# Altium project PCB_STM32F4.PrjPcb
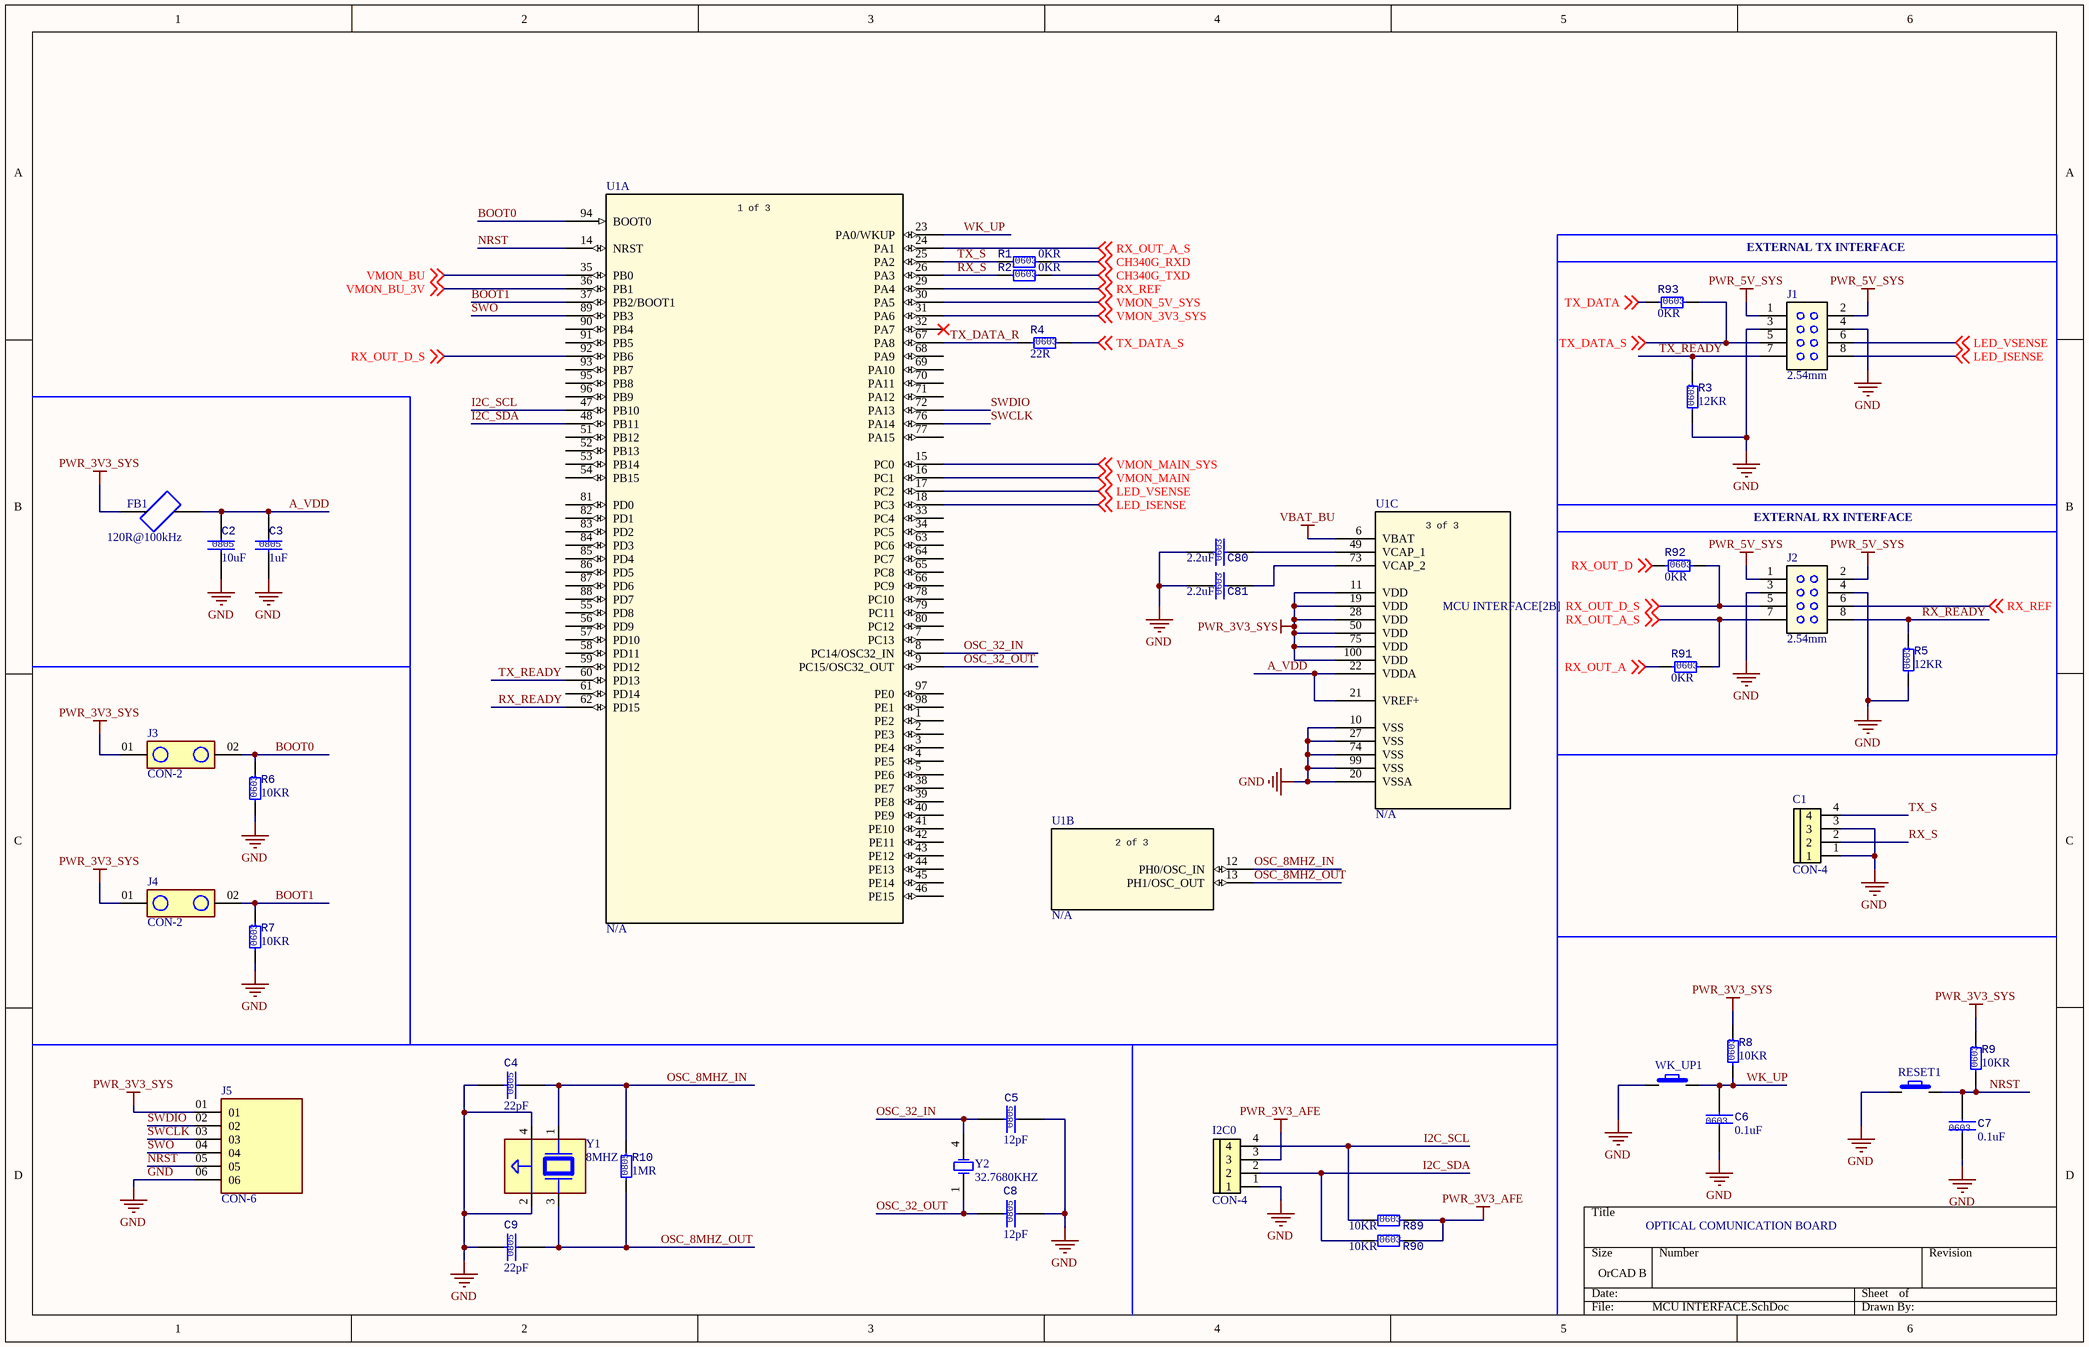
[diagram p0: MCU INTERFACE.SchDoc]
7 sheets, 233 parts. Net scope: global (net labels, ports and power ports of the same name join across sheets).
Board file: PCB1.PcbDoc
Sheets:
  MCU INTERFACE.SchDoc
  PW SUPPLY.SchDoc
  UART TO USB LOG.SchDoc
  Transmitter_MD.SchDoc
  Receiver_VLC.SchDoc
  VOLTAGE_MONITOR.SchDoc
  PWR_AFE.SchDoc

## Sheet MCU INTERFACE.SchDoc
size OrCAD B; SheetNumber: 1; SheetTotal: 7

### Parts
C1  value CON-4  [CON-4]  (hidden comment: CONNECTOR_4)
C2  Size: 0805  [CAPCER 0603 SMD]  (hidden comment: 10uF)
C3  Size: 0805  [CAPCER 0805 SMD]  (hidden comment: 1uF)
C4  value 22pF  Size: 0805  [CAPCER 0805 SMD]  (hidden comment: 22uF)
C5  Size: 0805  [CAPCER 0805 SMD]  (hidden comment: 12pF)
C6  Size: 0603  [CAPCER 0805 SMD]  (hidden comment: 0.1uF)
C7  Size: 0603  [CAPCER 0805 SMD]  (hidden comment: 0.1uF)
C8  Size: 0805  [CAPCER 0805 SMD]  (hidden comment: 12pF)
C9  value 22pF  Size: 0805  [CAPCER 0805 SMD]  (hidden comment: 22uF)
C80  Size: 0603  [CAPCER 0603 SMD]  (hidden comment: 2.2uF)
C81  Size: 0603  [CAPCER 0603 SMD]  (hidden comment: 2.2uF)
FB1  120R@100kHz  [FB 0805]
I2C0  value CON-4  [CON-4]  (hidden comment: CONNECTOR_4)
J1  value 2.54mm  [HD_2X4_2P54_M_V]  (hidden comment: HD_2X4_M_V)
J2  value 2.54mm  [HD_2X4_2P54_M_V]  (hidden comment: HD_2X4_M_V)
J3  value CON-2  [CON-2]  (hidden comment: CONNECTOR_2)
J4  value CON-2  [CON-2]  (hidden comment: CONNECTOR_2)
J5  value CON-6  [CON-6]  (hidden comment: CONNECTOR_6)
R1  value 0KR  Size: 0603  [RESC 0603(1608) SMD]  (hidden comment: 0R)
R2  value 0KR  Size: 0603  [RESC 0603(1608) SMD]  (hidden comment: 0R)
R3  Size: 0603  [RESC 0603(1608) SMD]  (hidden comment: 12KR)
R4  Size: 0603  [RESC 0603(1608) SMD]  (hidden comment: 22R)
R5  Size: 0603  [RESC 0603(1608) SMD]  (hidden comment: 12KR)
R6  Size: 0603  [RESC 0603(1608) SMD]  (hidden comment: 10KR)
R7  Size: 0603  [RESC 0603(1608) SMD]  (hidden comment: 10KR)
R8  Size: 0603  [RESC 0603(1608) SMD]  (hidden comment: 10KR)
R9  Size: 0603  [RESC 0603(1608) SMD]  (hidden comment: 10KR)
R10  value 1MR  Size: 0805  [CAPCER 0805 SMD]  (hidden comment: Điện Trở 1 MOhm 0805 1%)
R89  Size: 0603  [RESC 0603(1608) SMD]  (hidden comment: 10KR)
R90  Size: 0603  [RESC 0603(1608) SMD]  (hidden comment: 10KR)
R91  value 0KR  Size: 0603  [RESC 0603(1608) SMD]  (hidden comment: 0R)
R92  value 0KR  Size: 0603  [RESC 0603(1608) SMD]  (hidden comment: 0R)
R93  value 0KR  Size: 0603  [RESC 0603(1608) SMD]  (hidden comment: 0R)
RESET1  BUTTON  [BUTTON_SMD]  (value not drawn)
U1  STM32F407VET6  [100LQFP]  (value not drawn)  (parts A,B,C of 3)
WK_UP1  BUTTON  [BUTTON_SMD]  (value not drawn)
Y1  value 8MHZ  [XTAL_5032]  (hidden comment: XTAL_8Mhz)
Y2  value 32.7680KHZ  [4-SOJ]  (hidden comment: XTAL_32.786K)

### Nets
GND: C1.1 C1.3 C2.2 C3.2 C4.1 C5.2 C6.1 C7.1 C8.2 C9.1 C80.1 C81.1 I2C0.1 J1.3 J1.4 J2.3 J2.4 J5.06 R3.1 R5.1 R6.1 R7.1 RESET1.1 U1.10(VSS) U1.20(VSSA) U1.27(VSS) U1.74(VSS) U1.99(VSS) WK_UP1.1 Y1.2(GND) Y1.4(GND)
PWR_3V3_AFE: I2C0.3 R89.2 R90.2
PWR_3V3_SYS: FB1.1 J3.01 J4.01 J5.01 R8.2 R9.2 U1.11(VDD) U1.19(VDD) U1.28(VDD) U1.50(VDD) U1.75(VDD) U1.100(VDD)
PWR_5V_SYS: J1.1 J1.2 J2.1 J2.2
VBAT_BU: U1.6(VBAT)
A_VDD: C2.1 C3.1 FB1.2 U1.21(VREF+) U1.22(VDDA)
BOOT0: J3.02 R6.2 U1.94(BOOT0)
BOOT1: J4.02 R7.2 U1.37(PB2/BOOT1)
CH340G_RXD: R1.2 ; off-sheet CH340G_RXD
CH340G_TXD: R2.2 ; off-sheet CH340G_TXD
I2C_SCL: I2C0.4 R89.1 U1.47(PB10)
I2C_SDA: I2C0.2 R90.1 U1.48(PB11)
LED_ISENSE: J1.8 U1.18(PC3) ; off-sheet LED_ISENSE
LED_VSENSE: J1.6 U1.17(PC2) ; off-sheet LED_VSENSE
NRST: C7.2 J5.05 R9.1 RESET1.2 U1.14(NRST)
OSC_8MHZ_IN: C4.2 R10.2 U1.12(PH0/OSC_IN) Y1.1
OSC_8MHZ_OUT: C9.2 R10.1 U1.13(PH1/OSC_OUT) Y1.3
OSC_32_IN: C5.1 U1.8(PC14/OSC32_IN) Y2.4(OSC2)
OSC_32_OUT: C8.1 U1.9(PC15/OSC32_OUT) Y2.1(OSC1)
RX_OUT_A: R91.1 ; off-sheet RX_OUT_A
RX_OUT_A_S: J2.7 R91.2 U1.24(PA1) ; off-sheet RX_OUT_A_S
RX_OUT_D: R92.1 ; off-sheet RX_OUT_D
RX_OUT_D_S: J2.5 R92.2 U1.92(PB6) ; off-sheet RX_OUT_D_S
RX_READY: J2.8 R5.2 U1.62(PD15)
RX_REF: J2.6 U1.29(PA4) ; off-sheet RX_REF
RX_S: C1.2 R2.1 U1.26(PA3)
SWCLK: J5.03 U1.76(PA14)
SWDIO: J5.02 U1.72(PA13)
SWO: J5.04 U1.89(PB3)
TX_DATA: R93.1 ; off-sheet TX_DATA
TX_DATA_R: R4.1 U1.67(PA8)
TX_DATA_S: J1.5 R4.2 R93.2 ; off-sheet TX_DATA_S
TX_READY: J1.7 R3.2 U1.60(PD13)
TX_S: C1.4 R1.1 U1.25(PA2)
VMON_3V3_SYS: U1.31(PA6) ; off-sheet VMON_3V3_SYS
VMON_5V_SYS: U1.30(PA5) ; off-sheet VMON_5V_SYS
VMON_BU: U1.35(PB0) ; off-sheet VMON_BU
VMON_BU_3V: U1.36(PB1) ; off-sheet VMON_BU_3V
VMON_MAIN: U1.16(PC1) ; off-sheet VMON_MAIN
VMON_MAIN_SYS: U1.15(PC0) ; off-sheet VMON_MAIN_SYS
WK_UP: C6.2 R8.1 U1.23(PA0/WKUP) WK_UP1.2
NetC80_2: C80.2 U1.49(VCAP_1)
NetC81_2: C81.2 U1.73(VCAP_2)

Not connected (* = marked no-connect by the designer): U1 1(PE2) 2(PE3) 3(PE4) 4(PE5) 5(PE6) 7(PC13) 32(PA7)* 33(PC4) 34(PC5) 38(PE7) 39(PE8) 40(PE9) 41(PE10) 42(PE11) 43(PE12) 44(PE13) 45(PE14) 46(PE15) 51(PB12) 52(PB13) 53(PB14) 54(PB15) 55(PD8) 56(PD9) 57(PD10) 58(PD11) 59(PD12) 61(PD14) 63(PC6) 64(PC7) 65(PC8) 66(PC9) 68(PA9) 69(PA10) 70(PA11) 71(PA12) 77(PA15) 78(PC10) 79(PC11) 80(PC12) 81(PD0) 82(PD1) 83(PD2) 84(PD3) 85(PD4) 86(PD5) 87(PD6) 88(PD7) 90(PB4) 91(PB5) 93(PB7) 95(PB8) 96(PB9) 97(PE0) 98(PE1)

### Notes on the sheet
- EXTERNAL TX INTERFACE
- EXTERNAL RX INTERFACE
- OPTICAL COMUNICATION BOARD
- (in symbol DB-0071, part A) 1 of 3
- (in symbol DB-0071, part B) 2 of 3
- (in symbol DB-0071, part C) 3 of 3

### Library data of the parts
C1 I2C0 = DB-0049: Hàng Rào Đực Đơn 2.54mm 40 Chân 1 Hàng Cao 11.2mm Xuyên Lỗ; Design Item ID: DB-0049; Type: CONNECTOR; Power Rate: N/A; Tolerance: N/A; Footprint Type: TFT; Size: TFT; Supplier: THEGIOIIC; Supplier Part Number: Hàng Rào Đực Đơn 2.54mm 40 Chân 1 Hàng Cao 11.2mm Xuyên Lỗ; Supplier Link: https://www.thegioiic.com/hang-rao-duc-don-2-54mm-40-chan-1-hang-cao-11-2mm-xuyen-lo
C2 = DB-0018: CAPACITOR SMD 10uF 25V 10% 0805; Design Item ID: DB-0018; Value: 10uF; Type: CAPACITOR; Power Rate: N/A; Tolerance: 10%; Footprint Type: SMD; Supplier: THEGIOIIC; Supplier Part Number: Tụ Gốm 0805 10uF 25V; Supplier Link: https://www.thegioiic.com/tu-gom-0805-10uf-25v
C3 = DB-0063: CAPACITOR SMD 1uF 16V 10% 0805; Value: 1uF; Design Item ID: DB-0063; Type: CAPACITOR; Power Rate: N/A; Tolerance: 10%; Footprint Type: SMD; Supplier: THEGIOIIC; Supplier Part Number: Tụ Gốm 0805 1uF 16V; Supplier Link: https://www.thegioiic.com/tu-gom-0805-1uf-16v
C4 C9 = DB-0047: CAPACITOR SMD 22pF 50V 10% 0805; Design Item ID: DB-0047; Type: CAPACITOR; Power Rate: N/A; Tolerance: 10%; Footprint Type: SMD; Supplier: THEGIOIIC; Supplier Part Number: Tụ Gốm 0805 22pF 50V; Supplier Link: https://www.thegioiic.com/tu-gom-0805-22pf-50v
C5 C8 = DB-0075: CAPACITOR SMD 12pF 50V 10% 0805; Design Item ID: DB-0075; Type: CAPACITOR; Power Rate: N/A; Value: 12pF; Tolerance: 10%; Footprint Type: SMD; Supplier: THEGIOIIC; Supplier Part Number: Tụ Gốm 0805 12pF 50V; Supplier Link: https://www.thegioiic.com/tu-gom-0805-4-7uf-50v
C6 C7 = DB-0017: CAPACITOR SMD 0.1uF 50V 10% 0603; Value: 0.1uF; Design Item ID: DB-0017; Type: CAPACITOR; Power Rate: N/A; Tolerance: 10%; Footprint Type: SMD; Supplier: THEGIOIIC; Supplier Part Number: Tụ Gốm 0603 100nF (0.1uF) 25V; Supplier Link: https://www.thegioiic.com/tu-gom-0603-100nf-0-1uf-25v
C80 C81 = Tụ Gốm 0603 2.2uF 50V: Value: 2.2uF; Design Item ID: DB-0027; Footprint Type: SMD; Supplier: THEGIOIIC; Supplier Link: https://www.thegioiic.com/tu-gom-0603-2-2uf-50v
FB1 = DB-0076: CBW201209U121T Ferrite Beads 2A 120 Ohm 0805; Design Item ID: DB-0076; Value: 120R@100kHz; Type: FERRITE BEADS; Power Rate: N/A; Tolerance: N/A; Footprint Type: SMD; Size: 0805; Supplier: THEGIOIIC; Supplier Part Number: CBW201209U121T Ferrite Beads 2A 120 Ohm 0805; Supplier Link: https://www.thegioiic.com/cbw201209u121t-ferrite-beads-2a-120-ohm-0805
J1 J2 = DB-0006: Design Item ID: DB-0006; Type: HEADER; Footprint Type: THT; Size: HD_2X4_FM_RA; Supplier: THEGIOIIC; Supplier Link: https://www.thegioiic.com/hang-rao-duc-doi-2-54mm-80-chan-2-hang-cao-11-2mm-xuyen-lo-chan-ma-vang
J3 J4 = DB-0085: Hàng Rào Đực Đơn 2.54mm 40 Chân 1 Hàng Cao 11.2mm Xuyên Lỗ; Design Item ID: DB-0085; Type: CONNECTOR; Power Rate: N/A; Tolerance: N/A; Footprint Type: TFT; Size: TFT; Supplier: THEGIOIIC; Supplier Part Number: Hàng Rào Đực Đơn 2.54mm 40 Chân 1 Hàng Cao 11.2mm Xuyên Lỗ; Supplier Link: https://www.thegioiic.com/hang-rao-duc-don-2-54mm-40-chan-1-hang-cao-11-2mm-xuyen-lo
J5 = DB-0084: Hàng Rào Đực Đơn 2.54mm 40 Chân 1 Hàng Cao 11.2mm Xuyên Lỗ; Design Item ID: DB-0084; Type: CONNECTOR; Power Rate: N/A; Tolerance: N/A; Footprint Type: TFT; Size: TFT; Supplier: THEGIOIIC; Supplier Part Number: Hàng Rào Đực Đơn 2.54mm 40 Chân 1 Hàng Cao 11.2mm Xuyên Lỗ; Supplier Link: https://www.thegioiic.com/hang-rao-duc-don-2-54mm-40-chan-1-hang-cao-11-2mm-xuyen-lo
R1 R2 R91-R93 = DB-0040: RESISTOR SMD 0KR OHM 1% 100mW 0603; Power Rate: 100mW; Design Item ID: DB-0040; Type: RESISTOR; Tolerance: 1%; Footprint Type: SMD; Supplier: THEGIOIIC; Supplier Part Number: Điện Trở 0 Ohm 0603 1%; Supplier Link: https://www.thegioiic.com/dien-tro-0-ohm-0603-1-
R3 R5 = DB-0027: RESISTOR SMD 12KR OHM 1% 100mW 0603; Power Rate: 100mW; Design Item ID: DB-0027; Value: 12KR; Type: RESISTOR; Tolerance: 1%; Footprint Type: SMD; Supplier: THEGIOIIC; Supplier Part Number: Điện Trở 12 KOhm 0603 1%; Supplier Link: https://www.thegioiic.com/dien-tro-12-kohm-0603-1-
R4 = DB-0007: Power Rate: *; Design Item ID: DB-0007; Value: 22R; Type: RESISTOR; Footprint Type: SMD; Supplier: THEGIOIIC; Supplier Link: https://www.thegioiic.com/dien-tro-22-ohm-0603-1-
R6-R9 R89 R90 = DB-0003: RESISTOR SMD 10KR OHM 1% 100mW 0603; Power Rate: 100mW; Design Item ID: DB-0003; Value: 10KR; Type: RESISTOR; Tolerance: 1%; Footprint Type: SMD; Supplier: THEGIOIIC; Supplier Part Number: Điện Trở 10 KOhm 0603 1%; Supplier Link: https://www.thegioiic.com/dien-tro-10-kohm-0603-1-
R10 = DB-0074: RESISTOR SMD 1 MOHM 1% 100mW 0805; Power Rate: 100mW; Design Item ID: DB-0074; Type: RESISTOR; Tolerance: 1%; Footprint Type: SMD; Supplier: THEGIOIIC; Supplier Part Number: Điện Trở 1 MOhm 0805 1%; Supplier Link: https://www.thegioiic.com/dien-tro-1-mohm-0805-1-
RESET1 WK_UP1 = DB-0051: Nút Nhấn 4x4mm Cao 1.5mm 4 Chân SMD Chống Nước; Value: N/A; Design Item ID: DB-0051; Type: BUTTON; Power Rate: N/A; Tolerance: N/A; Footprint Type: SMD; Size: BUTTON_SMD; Supplier: THEGIOIIC; Supplier Part Number: Nút Nhấn 4x4mm Cao 1.5mm 4 Chân SMD Chống Nước; Supplier Link: https://www.thegioiic.com/nut-nhan-4x4mm-cao-1-5mm-4-chan-smd-chong-nuoc
U1 = DB-0071: IC MCU 32BIT 512KB FLASH 100LQFP; Design Item ID: DB-0071; Value: N/A; Type: MCU; Power Rate: N/A; Tolerance: N/A; Footprint Type: SMD; Size: 100LQFP; Supplier: THEGIOIIC
Y1 = DB-0008: Design Item ID: DB-0008; Type: XTAL; Footprint Type: SMD; Size: 5033; Supplier: THEGIOIIC; Supplier Link: https://www.thegioiic.com/thach-anh-12mhz-5032-4-chan-smd
Y2 = DB-0064: CRYSTAL 32.7680KHZ 12.5PF SMD; Design Item ID: DB-0064; Type: XTAL; Power Rate: N/A; Tolerance: N/A; Footprint Type: SMD; Size: 4-SOJ; Supplier: THEGIOIIC; Supplier Part Number: Thạch Anh 32.768KHz MC-306 4 Chân; Supplier Link: https://www.thegioiic.com/thach-anh-32-768khz-mc-306-4-chan

## Sheet PW SUPPLY.SchDoc
size OrCAD B; SheetNumber: 2; SheetTotal: 7
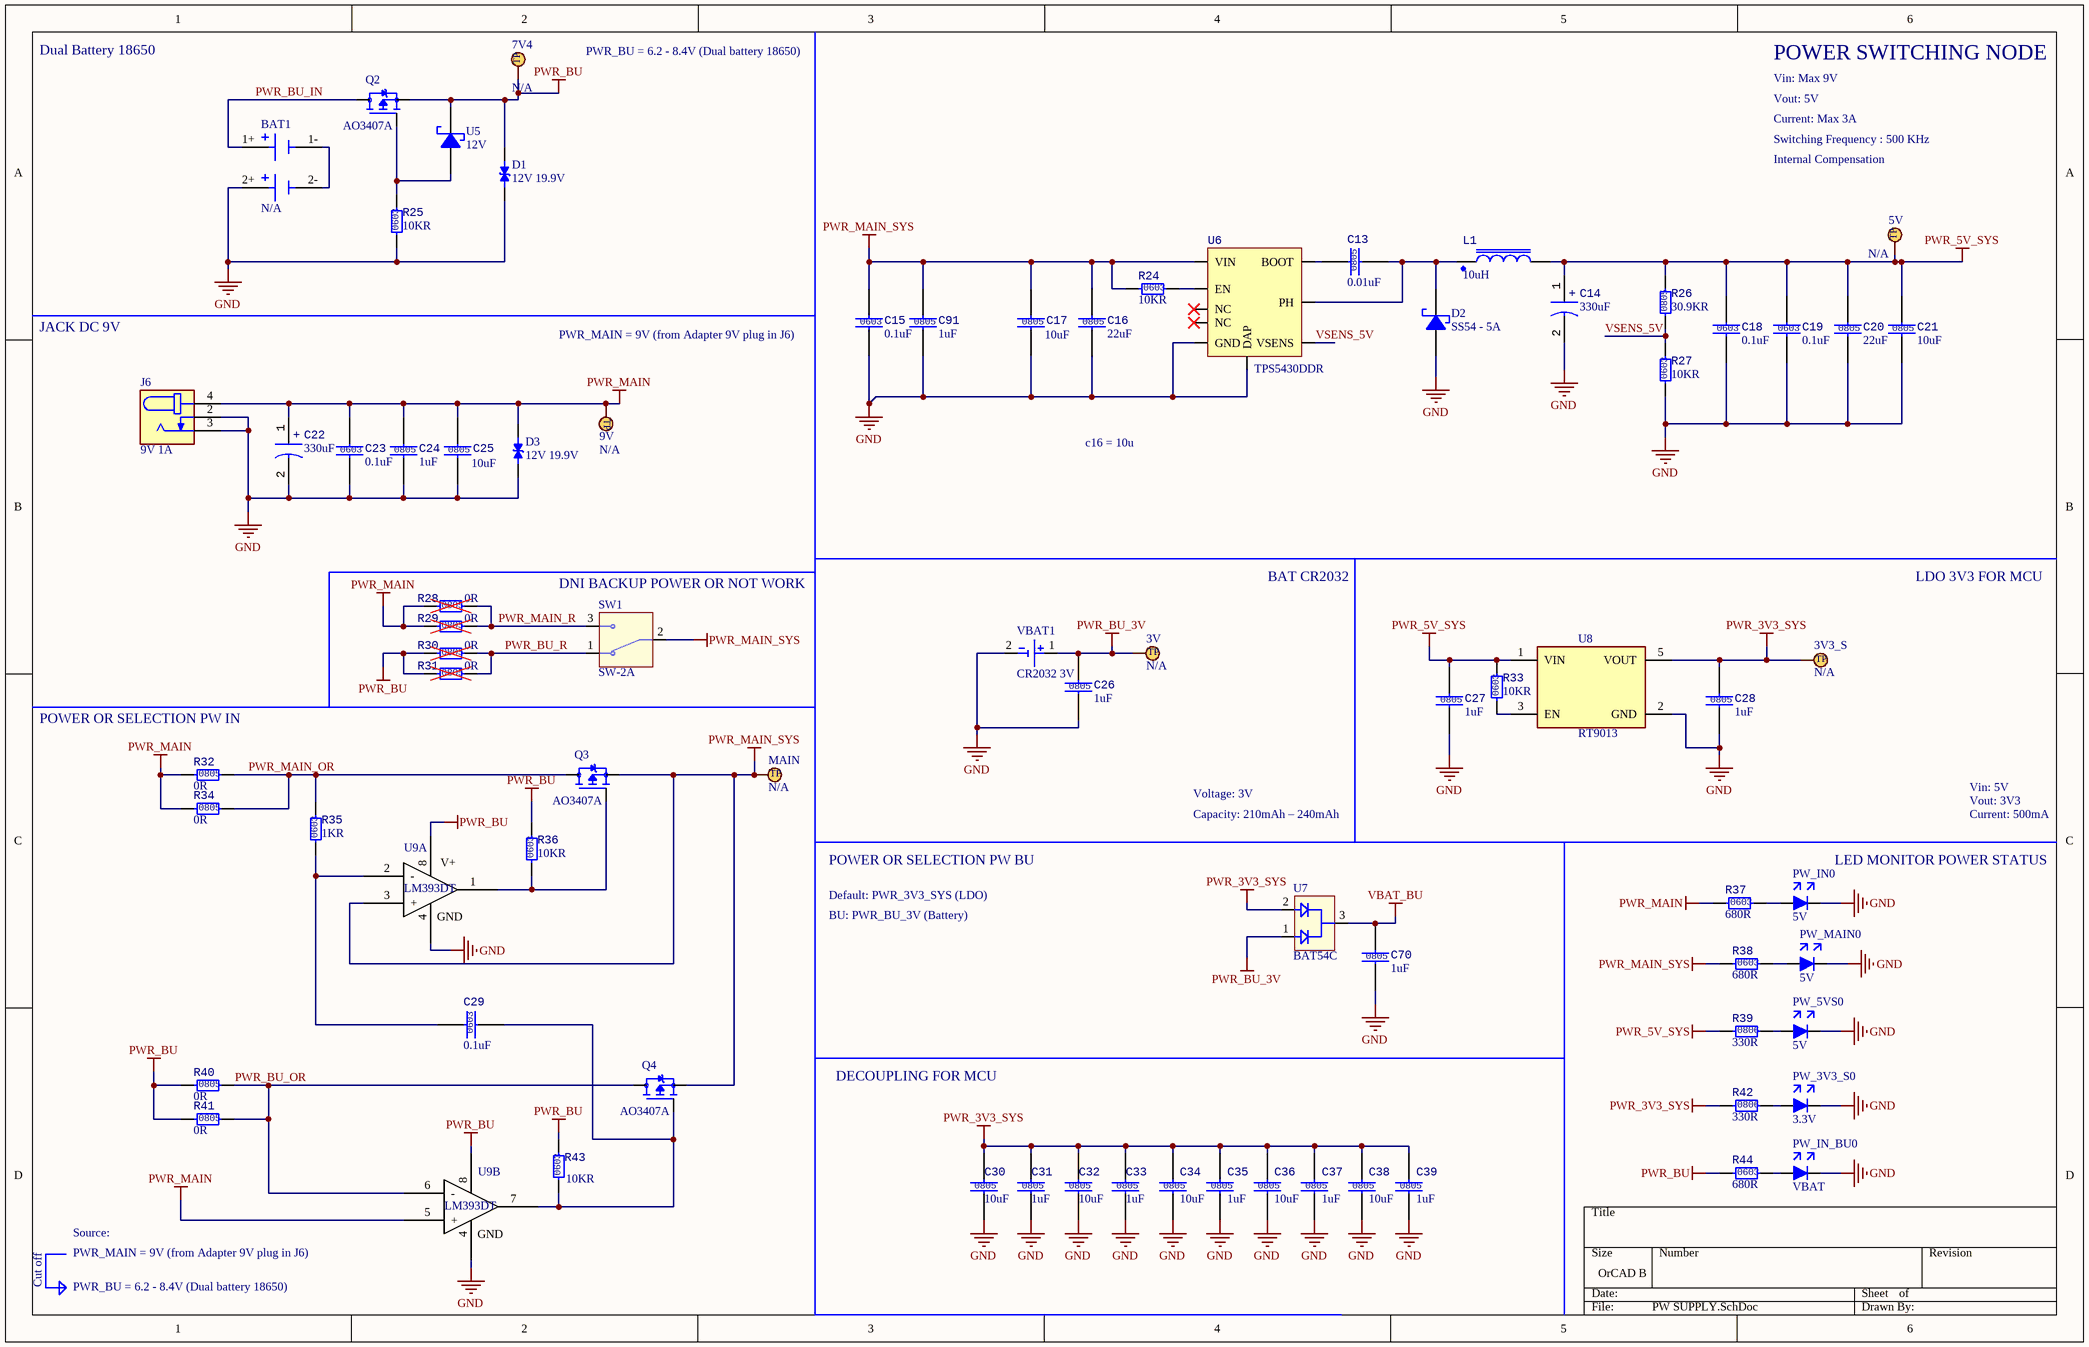
[diagram p1: PW SUPPLY.SchDoc]

### Parts
3V  TEST_POINT  [Test_point]  (value not drawn)
3V3_S  TEST_POINT  [Test_point]  (value not drawn)
5V  TEST_POINT  [Test_point]  (value not drawn)
7V4  TEST_POINT  [Test_point]  (value not drawn)
9V  TEST_POINT  [Test_point]  (value not drawn)
BAT1  Dual_Battery_Case  [Dual_BAT_PCB]  (value not drawn)
C13  Size: 0805  [CAPCER 0805 SMD]  (hidden comment: 0.01uF)
C14  330uF  [CAP ALU 6377]
C15  Size: 0603  [CAPCER 0805 SMD]  (hidden comment: 0.1uF)
C16  Size: 0805  [CAPCER 0805 SMD]  (hidden comment: 22uF)
C17  Size: 0805  [CAPCER 0603 SMD]  (hidden comment: 10uF)
C18  Size: 0603  [CAPCER 0805 SMD]  (hidden comment: 0.1uF)
C19  Size: 0603  [CAPCER 0805 SMD]  (hidden comment: 0.1uF)
C20  Size: 0805  [CAPCER 0805 SMD]  (hidden comment: 22uF)
C21  Size: 0805  [CAPCER 0603 SMD]  (hidden comment: 10uF)
C22  330uF  [CAP ALU 6377]
C23  Size: 0603  [CAPCER 0805 SMD]  (hidden comment: 0.1uF)
C24  Size: 0805  [CAPCER 0805 SMD]  (hidden comment: 1uF)
C25  Size: 0805  [CAPCER 0603 SMD]  (hidden comment: 10uF)
C26  Size: 0805  [CAPCER 0805 SMD]  (hidden comment: 1uF)
C27  Size: 0805  [CAPCER 0805 SMD]  (hidden comment: 1uF)
C28  Size: 0805  [CAPCER 0805 SMD]  (hidden comment: 1uF)
C29  Size: 0603  [CAPCER 0805 SMD]  (hidden comment: 0.1uF)
C30  Size: 0805  [CAPCER 0603 SMD]  (hidden comment: 10uF)
C31  Size: 0805  [CAPCER 0805 SMD]  (hidden comment: 1uF)
C32  Size: 0805  [CAPCER 0603 SMD]  (hidden comment: 10uF)
C33  Size: 0805  [CAPCER 0805 SMD]  (hidden comment: 1uF)
C34  Size: 0805  [CAPCER 0603 SMD]  (hidden comment: 10uF)
C35  Size: 0805  [CAPCER 0805 SMD]  (hidden comment: 1uF)
C36  Size: 0805  [CAPCER 0603 SMD]  (hidden comment: 10uF)
C37  Size: 0805  [CAPCER 0805 SMD]  (hidden comment: 1uF)
C38  Size: 0805  [CAPCER 0603 SMD]  (hidden comment: 10uF)
C39  Size: 0805  [CAPCER 0805 SMD]  (hidden comment: 1uF)
C70  Size: 0805  [CAPCER 0805 SMD]  (hidden comment: 1uF)
C91  Size: 0805  [CAPCER 0805 SMD]  (hidden comment: 1uF)
D1  value 12V 19.9V  [DO-214AC]  (hidden comment: SMAJ12A)
D2  value SS54 - 5A  [DO-214AC]  (hidden comment: SS54)
D3  value 12V 19.9V  [DO-214AC]  (hidden comment: SMAJ12A)
J6  9V 1A  [PW_JACK_DC_5525]
L1  10uH  [IND_8D43]
MAIN  TEST_POINT  [Test_point]  (value not drawn)
PW_3V3_S0  value 3.3V  [LED 0805 SMD]  (hidden comment: LED_RED)
PW_5VS0  value 5V  [LED 0805 SMD]  (hidden comment: LED_RED)
PW_IN0  value 5V  [LED 0805 SMD]  (hidden comment: LED_RED)
PW_IN_BU0  value VBAT  [LED 0805 SMD]  (hidden comment: LED_RED)
PW_MAIN0  value 5V  [LED 0805 SMD]  (hidden comment: LED_RED)
Q2  AO3407A  [SOT23-3]
Q3  AO3407A  [SOT23-3]
Q4  AO3407A  [SOT23-3]
R24  Size: 0603  [RESC 0603(1608) SMD]  (hidden comment: 10KR)
R25  Size: 0603  [RESC 0603(1608) SMD]  (hidden comment: 10KR)
R26  Size: 0805  [RESC 0805 SMD]  (hidden comment: 30.9KR)
R27  Size: 0603  [RESC 0603(1608) SMD]  (hidden comment: 10KR)
R28  Size: 0805  [RESC 0805 SMD]  (hidden comment: 0R)
R29  Size: 0805  [RESC 0805 SMD]  (hidden comment: 0R)
R30  Size: 0805  [RESC 0805 SMD]  (hidden comment: 0R)
R31  Size: 0805  [RESC 0805 SMD]  (hidden comment: 0R)
R32  Size: 0805  [RESC 0805 SMD]  (hidden comment: 0R)
R33  Size: 0603  [RESC 0603(1608) SMD]  (hidden comment: 10KR)
R34  Size: 0805  [RESC 0805 SMD]  (hidden comment: 0R)
R35  Size: 0603  [RESC 0603(1608) SMD]  (hidden comment: 1KR)
R36  Size: 0603  [RESC 0603(1608) SMD]  (hidden comment: 10KR)
R37  Size: 0603  [RESC 0603(1608) SMD]  (hidden comment: 680R)
R38  Size: 0603  [RESC 0603(1608) SMD]  (hidden comment: 680R)
R39  Size: 0806  [RESC 0805 SMD]  (hidden comment: 330R)
R40  Size: 0805  [RESC 0805 SMD]  (hidden comment: 0R)
R41  Size: 0805  [RESC 0805 SMD]  (hidden comment: 0R)
R42  Size: 0806  [RESC 0805 SMD]  (hidden comment: 330R)
R43  Size: 0603  [RESC 0603(1608) SMD]  (hidden comment: 10KR)
R44  Size: 0603  [RESC 0603(1608) SMD]  (hidden comment: 680R)
SW1  value SW-2A  [SLIDE-SW]  (hidden comment: SW 2A)
U5  value 12V  [SOD-123F]  (hidden comment: BZT52H)
U6  value TPS5430DDR  [8-SOIC]  (hidden comment: TPS5430DDAR)
U7  BAT54C  [SOT23-3]
U8  RT9013  [SOT-23-5]
U9  LM393DT  [8-SOIC-OPA]  (parts A,B of 2)
VBAT1  value CR2032 3V  [HOLDER BAT]  (hidden comment: HOL CR2032)

### Nets
GND: BAT1.2+ C14.2 C15.2 C16.2 C17.2 C18.2 C19.2 C20.2 C21.2 C22.2 C23.2 C24.2 C25.2 C26.2 C27.2 C28.2 C30.2 C31.2 C32.2 C33.2 C34.2 C35.2 C36.2 C37.2 C38.2 C39.2 C70.2 C91.2 D1.1 D2.1(A) D3.1 J6.2 J6.3 PW_3V3_S0.C(K) PW_5VS0.C(K) PW_IN0.C(K) PW_IN_BU0.C(K) PW_MAIN0.C(K) R25.1 R27.1 U6.6(GND) U6.9(DAP) U8.2(GND) U9.4(GND) VBAT1.2(NEG)
PWR_3V3_SYS: 3V3_S.1 C28.1 C30.1 C31.1 C32.1 C33.1 C34.1 C35.1 C36.1 C37.1 C38.1 C39.1 R42.1 U7.2 U8.5(VOUT)
PWR_5V_SYS: 5V.1 C14.1 C18.1 C19.1 C20.1 C21.1 C27.1 L1.2 R26.2 R33.2 R39.1 U8.1(VIN)
PWR_BU: 7V4.1 D1.2 Q2.2(S) R30.1 R31.1 R36.2 R40.1 R41.1 R43.2 R44.1 U5.2(K) U9.8(VCC)
PWR_BU_3V: 3V.1 C26.1 U7.1 VBAT1.1(POS)
PWR_MAIN: 9V.1 C22.1 C23.1 C24.1 C25.1 D3.2 J6.4 R28.1 R29.1 R32.1 R34.1 R37.1 U9.5(+)
PWR_MAIN_SYS: C15.1 C16.1 C17.1 C91.1 MAIN.1 Q3.2(S) Q4.2(S) R24.1 R38.1 SW1.2 U6.7(VIN) U9.3(+)
VBAT_BU: C70.1 U7.3
PWR_BU_IN: BAT1.1+ Q2.3(D)
PWR_BU_OR: Q4.3(D) R40.2 R41.2 U9.6(-)
PWR_BU_R: R30.2 R31.2 SW1.1
PWR_MAIN_OR: Q3.3(D) R32.2 R34.2 R35.2
PWR_MAIN_R: R28.2 R29.2 SW1.3
VSENS_5V: R26.1 R27.2 U6.4(VSENS)
NetBAT1_1-: BAT1.1- BAT1.2-
NetC13_1: C13.1 U6.1(BOOT)
NetC13_2: C13.2 D2.2(K) L1.1 U6.8(PH)
NetC29_1: C29.1 R35.1 U9.2(-)
NetC29_2: C29.2 Q4.1(G) R43.1 U9.7(OUT_2)
NetPW_3V3_S0_A: PW_3V3_S0.A R42.2
NetPW_5VS0_A: PW_5VS0.A R39.2
NetPW_IN0_A: PW_IN0.A R37.2
NetPW_IN_BU0_A: PW_IN_BU0.A R44.2
NetPW_MAIN0_A: PW_MAIN0.A R38.2
NetQ2_1: Q2.1(G) R25.2 U5.1(A)
NetQ3_1: Q3.1(G) R36.1 U9.1(OUT_1)
NetR24_2: R24.2 U6.5(EN)
NetR33_1: R33.1 U8.3(EN)

Not connected (* = marked no-connect by the designer): U6 2(NC)* 3(NC)*

### Notes on the sheet
- Dual Battery 18650
- PWR_BU = 6.2 - 8.4V (Dual battery 18650)
- POWER SWITCHING NODE
- Vin: Max 9V
- Vout: 5V
- Current: Max 3A
- Switching Frequency : 500 KHz
- Internal Compensation
- JACK DC 9V
- PWR_MAIN = 9V (from Adapter 9V plug in J6)
- c16 = 10u
- (near SW1) DNI BACKUP POWER OR NOT WORK
- BAT CR2032
- LDO 3V3 FOR MCU
- (near R32) POWER OR SELECTION PW IN
- Voltage: 3V
- Capacity: 210mAh – 240mAh
- Vin: 5V
- Vout: 3V3
- Current: 500mA
- POWER OR SELECTION PW BU
- (near PW_IN0) LED MONITOR POWER STATUS
- Default: PWR_3V3_SYS (LDO)
- BU: PWR_BU_3V (Battery)
- DECOUPLING FOR MCU
- Source:
- Cut off
- (in symbol DB-0010, part A) V+
- (in symbol DB-0034) TP
- (in symbol DB-0044) +

### Library data of the parts
3V 3V3_S 5V 7V4 9V MAIN = DB-0034: Value: N/A; Design Item ID: DB-0034; Power Rate: N/A; Tolerance: N/A; Footprint Type: PAD; Size: PAD
BAT1 = DB-0031: Dual_Battery_Case_18650; Value: N/A; Footprint Path: .\Database_Library\Library.PcbLib; Design Item ID: DB-0031; Type: Case; Power Rate: N/A; Tolerance: N/A; Footprint Type: TFT; Supplier Link: https://www.thegioiic.com/de-pin-2x18650-han-pcb
C13 = DB-0010: CAPACITOR SMD 0.01uF 50V 10% 0805; Value: 0.01uF; Footprint Path: .\Database_Library\Library.PcbLib; Design Item ID: DB-0010; Type: CAPACITOR; Power Rate: N/A; Tolerance: 10%; Footprint Type: SMD; Supplier: THEGIOIIC; Supplier Part Number: Tụ Gốm 0805 410nF 50V; Supplier Link: https://www.thegioiic.com/tu-gom-0805-10nf-50v
C14 C22 = DB-0044: CAPACITOR ALU SMD 220uF 6.3V 20% 6377; Value: 330uF; Design Item ID: DB-0044; Type: CAPACITOR ALU; Power Rate: N/A; Tolerance: 20%; Footprint Type: SMD; Size: 6377; Supplier: THEGIOIIC; Supplier Part Number: Tụ Nhôm SMD 330uF 6.3V 6.3x7.7mm; Supplier Link: https://www.thegioiic.com/tu-nhom-smd-330uf-6-3v-6-3x7-7mm
C15 C18 C19 C23 C29 = DB-0017: CAPACITOR SMD 0.1uF 50V 10% 0603; Value: 0.1uF; Design Item ID: DB-0017; Type: CAPACITOR; Power Rate: N/A; Tolerance: 10%; Footprint Type: SMD; Supplier: THEGIOIIC; Supplier Part Number: Tụ Gốm 0603 100nF (0.1uF) 25V; Supplier Link: https://www.thegioiic.com/tu-gom-0603-100nf-0-1uf-25v
  C15 C18 C19 C23: Footprint Path: .\Database_Library\Library.PcbLib
C16 C20 = DB-0056: CAPACITOR SMD 22uF 50V 10% 0805; Design Item ID: DB-0056; Value: 22uF; Type: CAPACITOR; Power Rate: N/A; Tolerance: 10%; Footprint Type: SMD; Supplier: THEGIOIIC; Supplier Part Number: Tụ Gốm 0805 22uF 6.3V; Supplier Link: https://www.thegioiic.com/tu-gom-0805-22uf-6-3v
C17 C21 C25 C30 C32 C34 C36 C38 = DB-0018: CAPACITOR SMD 10uF 25V 10% 0805; Value: 10uF; Design Item ID: DB-0018; Type: CAPACITOR; Power Rate: N/A; Tolerance: 10%; Footprint Type: SMD; Supplier: THEGIOIIC; Supplier Part Number: Tụ Gốm 0805 10uF 25V; Supplier Link: https://www.thegioiic.com/tu-gom-0805-10uf-25v
  C17 C25: Footprint Path: .\Database_Library\Library.PcbLib
C24 C26-C28 C31 C33 C35 C37 C39 C70 C91 = DB-0063: CAPACITOR SMD 1uF 16V 10% 0805; Design Item ID: DB-0063; Value: 1uF; Type: CAPACITOR; Power Rate: N/A; Tolerance: 10%; Footprint Type: SMD; Supplier: THEGIOIIC; Supplier Part Number: Tụ Gốm 0805 1uF 16V; Supplier Link: https://www.thegioiic.com/tu-gom-0805-1uf-16v
D1 D3 = DB-0078: TVS DIODE 12V 19.9V DO214AC; Design Item ID: DB-0078; Type: DIODE; Power Rate: N/A; Tolerance: N/A; Footprint Type: SMD; Size: SMA; Supplier: DIGIKEY; Supplier Part Number: TVS DIODE 5VWM 9.2VC SMA; Supplier Link: https://www.digikey.com/en/products/detail/diodes-incorporated/smaj5-0a-13/278666
D2 = DB-0029: Design Item ID: DB-0029; Footprint Type: SMD
J6 = DB-0009: Design Item ID: DB-0009; Value: 9V 1A; Footprint Type: THT; Size: 5525
L1 = Cuộn Cảm Dán SMD 8D43-100 10uH 5.5A: Value: 10uH; Design Item ID: DB-0011; Footprint Type: SMD; Size: IND_8D43; Supplier: THEGIOIIC; Supplier Link: https://www.thegioiic.com/cuon-cam-dan-smd-8d43-100-10uh-5-5a
PW_3V3_S0 PW_5VS0 PW_IN0 PW_IN_BU0 PW_MAIN0 = DB-0020: Size 2x1.2mm, điện áp 1.8-2.6VDC; Design Item ID: DB-0020; Type: LED; Power Rate: N/A; Tolerance: N/A; Footprint Type: SMD; Size: 0806; Supplier: THEGIOIIC; Supplier Part Number: LED Đỏ 0805 Dán SMD Trong Suốt Harvatek; Supplier Link: https://www.thegioiic.com/led-do-0805-dan-smd-trong-suot-harvatek
Q2-Q4 = DB-0041: AO3407A MOSFET Kênh P 30V 4.3A SOT-23-3; Type: P_MOSFET; Value: AO3407A; Design Item ID: DB-0041; Power Rate: N/A; Tolerance: N/A; Footprint Type: SMD; Size: SOT23-3; Supplier: THEGIOIIC; Supplier Part Number: AO3407A MOSFET Kênh P 30V 4.3A SOT-23-3; Supplier Link: https://www.thegioiic.com/ao3407a-mosfet-kenh-p-30v-4-3a-sot-23-3
R24 R25 R27 R33 R36 R43 = DB-0003: RESISTOR SMD 10KR OHM 1% 100mW 0603; Power Rate: 100mW; Value: 10KR; Design Item ID: DB-0003; Type: RESISTOR; Tolerance: 1%; Footprint Type: SMD; Supplier: THEGIOIIC; Supplier Part Number: Điện Trở 10 KOhm 0603 1%; Supplier Link: https://www.thegioiic.com/dien-tro-10-kohm-0603-1-
  R24 R27: Footprint Path: .\Database_Library\Library.PcbLib
R26 = DB-0012: Điện Trở 30.9 KOhm 0805 1%; Power Rate: *; Design Item ID: DB-0012; Value: 30.9KR; Type: RESISTOR; Footprint Type: SMD; Supplier: THEGIOIIC; Supplier Link: https://www.thegioiic.com/dien-tro-30-9-kohm-0805-1-
R28-R32 R34 R40 R41 = DB-0015: Power Rate: *; Design Item ID: DB-0015; Value: 0R; Type: RESISTOR; Footprint Type: SMD; Supplier: THEGIOIIC; Supplier Link: https://www.thegioiic.com/san-pham/dien-tro-dan-smd?prid=21990
R35 = DB-0081: RESISTOR SMD 1KR OHM 1% 100mW 0603; Power Rate: 100mW; Design Item ID: DB-0081; Value: 1KR; Type: RESISTOR; Tolerance: 1%; Footprint Type: SMD; Supplier: THEGIOIIC; Supplier Part Number: Điện Trở 1 KOhm 0603 1%; Supplier Link: https://www.thegioiic.com/dien-tro-1-kohm-0603-1-
R37 R38 R44 = DB-0001: RESISTOR SMD 680R OHM 5% 100mW 0603; Power Rate: 100mW; Value: 680R; Design Item ID: DB-0001; Type: RESISTOR; Tolerance: 5%; Footprint Type: SMD; Supplier: THEGIOIIC; Supplier Part Number: Điện Trở 680 Ohm 0603 5%; Supplier Link: https://www.thegioiic.com/dien-tro-680-ohm-0603-5-
R39 R42 = DB-0048: RESISTOR SMD 330R OHM 1% 125mW 0805; Power Rate: 125mW; Value: 330R; Design Item ID: DB-0048; Type: RESISTOR; Tolerance: 1%; Footprint Type: SMD; Supplier: THEGIOIIC; Supplier Part Number: Điện Trở 330 Ohm 0805 1%; Supplier Link: https://www.thegioiic.com/dien-tro-330-ohm-0805-1-
SW1 = DB-0083: SS-12F23G4 Công Tắc Trượt 5 Chân Xuyên Lỗ ON-OFF Chỉnh Ngang 1P2T 2A; Design Item ID: DB-0083; Type: SLIDE SWITCH; Power Rate: 2A; Tolerance: N/A; Footprint Type: TFT; Size: SW-TH; Supplier: THEGIOIIC; Supplier Part Number: SS-12F23G4 Công Tắc Trượt 5 Chân Xuyên Lỗ ON-OFF Chỉnh Ngang 1P2T 2A; Supplier Link: https://www.thegioiic.com/ss-12f23g4-cong-tac-truot-5-chan-xuyen-lo-on-off-chinh-ngang-1p2t-2a
U5 = DB-0042: BZT52H-C12 Diode Zener 12V 375mW SOD-123F; Tolerance: 5%; Design Item ID: DB-0042; Type: DIODE_ZE; Power Rate: 375mW; Footprint Type: SMD; Size: SOD-123F; Supplier: THEGIOIIC; Supplier Part Number: BZT52H-C12 Diode Zener 12V 375mW SOD-123F; Supplier Link: https://www.thegioiic.com/bzt52c5v1-diode-zener-5-1v-500mw
U6 = DB-0002: TPS543x 3A, Wide Input Range, Step-Down Converter; Footprint Path: .\Database_Library\Library.PcbLib; Design Item ID: DB-0002; Type: IC; Power Rate: N/A; Tolerance: N/A; Footprint Type: SMD; Size: 8-SOIC; Supplier: THEGIOIIC; Supplier Part Number: TPS5430DDAR IC Điều Chỉnh Giảm Áp 3A 8-SOIC; Supplier Link: https://www.thegioiic.com/tps5430ddar-ic-dieu-chinh-giam-ap-3a-8-soic
U7 = DB-0013: DIODE ARRAY SCHOTTKY 30V SOT23-3; Design Item ID: DB-0013; Value: BAT54C; Type: DIODE SCHOTTKY; Footprint Type: SMD; Size: SOT23; Supplier: THEGIOIIC; Supplier Link: https://www.thegioiic.com/bat54c
U8 = DB-0062: IC REG LINEAR 3.3V 500MA SOT23-5; Value: RT9013; Design Item ID: DB-0062; Type: IC; Power Rate: N/A; Tolerance: N/A; Footprint Type: SMD; Size: SOT-23-5; Supplier: THEGIOIIC; Supplier Part Number: RT9013-33GB IC Ổn Áp 3.3V 500mA SOT-23-5; Supplier Link: https://www.thegioiic.com/rt9013-33gb-ic-on-ap-3-3v-500ma-sot-23-5
U9 = DB-0010: Design Item ID: DB-0010; Value: LM393DT; Footprint Type: SMD; Size: 8-SOIC; Supplier: THEGIOIIC
VBAT1 = DB-0072: BS-6 Đế Pin CR2032 CR2025 Dán SMD; Design Item ID: DB-0072; Type: HOLDER BAT; Power Rate: N/A; Tolerance: N/A; Footprint Type: SMD; Size: SMD; Supplier: THEGIOIIC; Supplier Part Number: BS-6 Đế Pin CR2032 CR2025 Dán SMD; Supplier Link: https://www.thegioiic.com/bs-6-de-pin-cr2032-cr2025-dan-smd

## Sheet UART TO USB LOG.SchDoc
size A; SheetNumber: 3; SheetTotal: 7
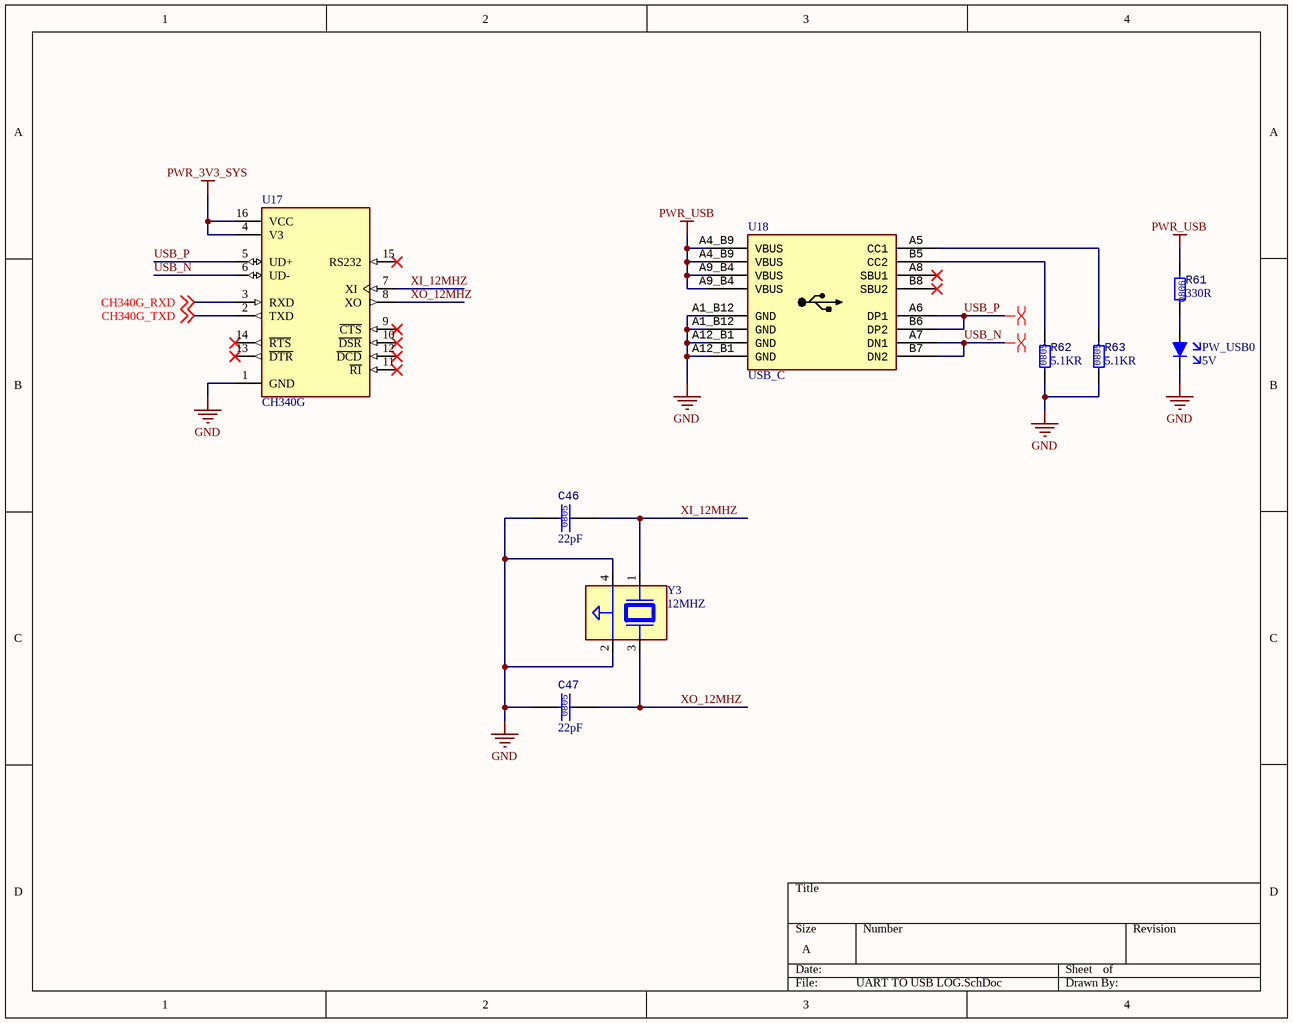
[diagram p2: UART TO USB LOG.SchDoc]

### Parts
C46  Size: 0805  [CAPCER 0805 SMD]  (hidden comment: 22pF)
C47  Size: 0805  [CAPCER 0805 SMD]  (hidden comment: 22pF)
PW_USB0  value 5V  [LED 0805 SMD]  (hidden comment: LED_RED)
R61  Size: 0806  [RESC 0805 SMD]  (hidden comment: 330R)
R62  Size: 0805  [RESC 0805 SMD]  (hidden comment: 5.1KR)
R63  Size: 0805  [RESC 0805 SMD]  (hidden comment: 5.1KR)
U17  CH340G  [SOP-16]
U18  value USB_C  [TYPEC-16POS]  (hidden comment: USB_TYPE_C)
Y3  value 12MHZ  [XTAL_5032]  (hidden comment: XTAL_12Mhz)

### Nets
GND: C46.1 C47.1 PW_USB0.C(K) R62.1 R63.1 U17.1(GND) U18.A1_B12(GND) U18.A12_B1(GND) Y3.2(GND) Y3.4(GND)
PWR_3V3_SYS: U17.4(V3) U17.16(VCC)
PWR_USB: R61.1 U18.A4_B9(VBUS) U18.A9_B4(VBUS)
CH340G_RXD: U17.3(RXD) ; off-sheet CH340G_RXD
CH340G_TXD: U17.2(TXD) ; off-sheet CH340G_TXD
USB_N: U17.6(UD-) U18.A7(DN1) U18.B7(DN2)
USB_P: U17.5(UD+) U18.A6(DP1) U18.B6(DP2)
XI_12MHZ: C46.2 U17.7(XI) Y3.1
XO_12MHZ: C47.2 U17.8(XO) Y3.3
NetPW_USB0_A: PW_USB0.A R61.2
NetR62_2: R62.2 U18.B5(CC2)
NetR63_2: R63.2 U18.A5(CC1)

Not connected (* = marked no-connect by the designer): U17 9(~{CTS})* 10(~{DSR})* 11(~{RI})* 12(~{DCD})* 13(~{DTR})* 14(~{RTS})* 15(RS232)*; U18 A8(SBU1)* B8(SBU2)*

### Layout directives
differential pair: USB_N, USB_P

### Library data of the parts
C46 C47 = DB-0047: CAPACITOR SMD 22pF 50V 10% 0805; Design Item ID: DB-0047; Value: 22pF; Type: CAPACITOR; Power Rate: N/A; Tolerance: 10%; Footprint Type: SMD; Supplier: THEGIOIIC; Supplier Part Number: Tụ Gốm 0805 22pF 50V; Supplier Link: https://www.thegioiic.com/tu-gom-0805-22pf-50v
PW_USB0 = DB-0020: Size 2x1.2mm, điện áp 1.8-2.6VDC; Design Item ID: DB-0020; Type: LED; Power Rate: N/A; Tolerance: N/A; Footprint Type: SMD; Size: 0806; Supplier: THEGIOIIC; Supplier Part Number: LED Đỏ 0805 Dán SMD Trong Suốt Harvatek; Supplier Link: https://www.thegioiic.com/led-do-0805-dan-smd-trong-suot-harvatek
R61 = DB-0048: RESISTOR SMD 330R OHM 1% 125mW 0805; Power Rate: 125mW; Value: 330R; Design Item ID: DB-0048; Type: RESISTOR; Tolerance: 1%; Footprint Type: SMD; Supplier: THEGIOIIC; Supplier Part Number: Điện Trở 330 Ohm 0805 1%; Supplier Link: https://www.thegioiic.com/dien-tro-330-ohm-0805-1-
R62 R63 = DB-0002: Power Rate: *; Design Item ID: DB-0002; Value: 5.1KR; Type: RESISTOR; Footprint Type: SMD; Supplier: THEGIOIIC; Supplier Link: https://www.thegioiic.com/dien-tro-5-1-kohm-0805-1-
U17 = DB-0087: Design Item ID: DB-0087; Value: CH340G
U18 = DB-0088: Design Item ID: DB-0088; Type: USB
Y3 = DB-0001: Design Item ID: DB-0001; Type: XTAL; Footprint Type: SMD; Size: 5033; Supplier: THEGIOIIC; Supplier Link: https://www.thegioiic.com/thach-anh-12mhz-5032-4-chan-smd

## Sheet Transmitter_MD.SchDoc
size A; SheetNumber: 4; SheetTotal: 7
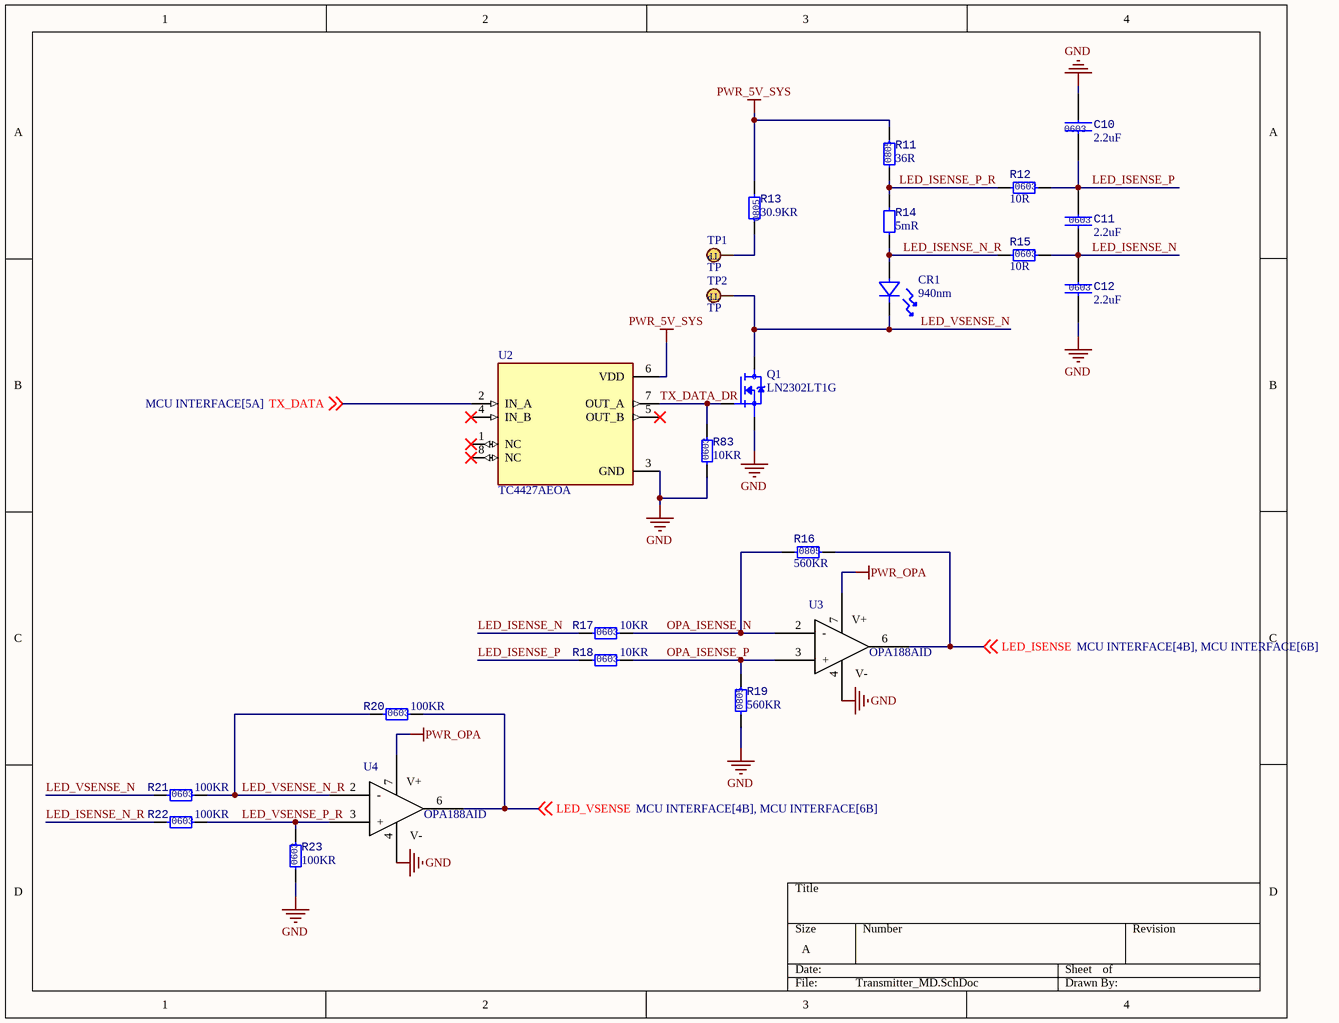
[diagram p3: Transmitter_MD.SchDoc]

### Parts
C10  Size: 0603  [CAPCER 0603 SMD]  (hidden comment: 2.2uF)
C11  Size: 0603  [CAPCER 0603 SMD]  (hidden comment: 2.2uF)
C12  Size: 0603  [CAPCER 0603 SMD]  (hidden comment: 2.2uF)
CR1  value 940nm  [TSAL6100]  (hidden comment: LED IR 940nm)
Q1  value LN2302LT1G  [SOT23-3]  (hidden comment: NMOS)
R11  Size: 0805  [RESC 0805 SMD]  (hidden comment: 36R)
R12  Size: 0603  [RESC 0603(1608) SMD]  (hidden comment: 10R)
R13  Size: 0805  [RESC 0805 SMD]  (hidden comment: 30.9KR)
R14  5mR  [RS_P10_D1P5]
R15  Size: 0603  [RESC 0603(1608) SMD]  (hidden comment: 10R)
R16  Size: 0805  [RESC 0805 SMD]  (hidden comment: 560KR)
R17  Size: 0603  [RESC 0603(1608) SMD]  (hidden comment: 10KR)
R18  Size: 0603  [RESC 0603(1608) SMD]  (hidden comment: 10KR)
R19  Size: 0805  [RESC 0805 SMD]  (hidden comment: 560KR)
R20  Size: 0603  [RESC 0603(1608) SMD]  (hidden comment: 100KR)
R21  Size: 0603  [RESC 0603(1608) SMD]  (hidden comment: 100KR)
R22  Size: 0603  [RESC 0603(1608) SMD]  (hidden comment: 100KR)
R23  Size: 0603  [RESC 0603(1608) SMD]  (hidden comment: 100KR)
R83  Size: 0603  [RESC 0603(1608) SMD]  (hidden comment: 10KR)
TP1  value TP  [TP_THT_1P0]  (hidden comment: TEST POINT)
TP2  value TP  [TP_THT_1P0]  (hidden comment: TEST POINT)
U2  TC4427AEOA  [8-SOIC-OPA]
U3  OPA188AID  [8-SOIC-OPA]
U4  OPA188AID  [8-SOIC-OPA]

### Nets
GND: C10.2 C12.2 Q1.2(S) R19.1 R23.1 R83.1 U2.3(GND) U3.4(GND) U4.4(GND)
PWR_5V_SYS: R11.2 R13.1 U2.6(VDD)
PWR_OPA: U3.7(VCC) U4.7(VCC)
LED_ISENSE: R16.2 U3.6(OUT_1) ; off-sheet LED_ISENSE
LED_ISENSE_N: C11.2 C12.1 R15.2 R17.1
LED_ISENSE_N_R: CR1.A R14.1 R15.1 R22.1
LED_ISENSE_P: C10.1 C11.1 R12.2 R18.1
LED_ISENSE_P_R: R11.1 R12.1 R14.2
LED_VSENSE: R20.2 U4.6(OUT_1) ; off-sheet LED_VSENSE
LED_VSENSE_N: CR1.K Q1.3(D) R21.1 TP2.1
LED_VSENSE_N_R: R20.1 R21.2 U4.2(-)
LED_VSENSE_P_R: R22.2 R23.2 U4.3(+)
OPA_ISENSE_N: R16.1 R17.2 U3.2(-)
OPA_ISENSE_P: R18.2 R19.2 U3.3(+)
TX_DATA: U2.2(IN_A) ; off-sheet TX_DATA
TX_DATA_DR: Q1.1(G) R83.2 U2.7(OUT_A)
NetR13_2: R13.2 TP1.1

Not connected (* = marked no-connect by the designer): U2 1(NC)* 4(IN_B)* 5(OUT_B)* 8(NC)*

### Notes on the sheet
- (in symbol DB-0014) V+; V-

### Library data of the parts
C10-C12 = DB-0027: Tụ Gốm 0603 2.2uF 50V; Design Item ID: DB-0027; Value: 2.2uF; Footprint Type: SMD; Supplier: THEGIOIIC; Supplier Link: https://www.thegioiic.com/tu-gom-0603-2-2uf-50v
CR1 = DB-0016: Type: LED IR; Design Item ID: DB-0016; Footprint Type: DIP; Size: THT; Supplier: THEGIOIIC
Q1 = DB-0018: LN2302LT1G MOSFET Kênh N 20V 2.3A SOT-23-3; Design Item ID: DB-0018; Type: MOSFET; Footprint Type: SMD; Size: SOT23; Supplier: THEGIOIIC
R11 = DB-0017: Power Rate: *; Design Item ID: DB-0017; Value: 36R; Type: RESISTOR; Footprint Type: SMD; Supplier: THEGIOIIC; Supplier Link: https://www.thegioiic.com/dien-tro-36-ohm-0805-5-
R12 R15 = DB-0028: Điện Trở 10 Ohm 0603 1%; Power Rate: *; Design Item ID: DB-0028; Value: 10R; Type: RESISTOR; Footprint Type: SMD; Supplier: THEGIOIIC; Supplier Link: https://www.thegioiic.com/dien-tro-10-ohm-0603-1-
R13 = DB-0012: Điện Trở 30.9 KOhm 0805 1%; Power Rate: *; Design Item ID: DB-0012; Value: 30.9KR; Type: RESISTOR; Footprint Type: SMD; Supplier: THEGIOIIC; Supplier Link: https://www.thegioiic.com/dien-tro-30-9-kohm-0805-1-
R14 = DB-0004: Power Rate: *; Size: ±1%; Design Item ID: DB-0004; Value: 5mR; Footprint Type: THT; Supplier: THEGIOIIC; Supplier Link: https://www.thegioiic.com/dien-tro-sense-0-005-ohm-5mr
R16 R19 = DB-0026: Power Rate: *; Design Item ID: DB-0026; Value: 560KR; Footprint Type: SMD; Supplier: THEGIOIIC
R17 R18 R83 = DB-0003: RESISTOR SMD 10KR OHM 1% 100mW 0603; Power Rate: 100mW; Design Item ID: DB-0003; Value: 10KR; Type: RESISTOR; Tolerance: 1%; Footprint Type: SMD; Supplier: THEGIOIIC; Supplier Part Number: Điện Trở 10 KOhm 0603 1%; Supplier Link: https://www.thegioiic.com/dien-tro-10-kohm-0603-1-
R20-R23 = DB-0008: RESISTOR SMD 100KR OHM 1% 100mW 0603; Power Rate: 100mW; Design Item ID: DB-0008; Value: 100KR; Type: RESISTOR; Tolerance: 1%; Footprint Type: SMD; Supplier: THEGIOIIC; Supplier Part Number: Điện Trở 100 KOhm 0603 1%; Supplier Link: https://www.thegioiic.com/dien-tro-100-kohm-0603-1-
TP1 TP2 = DB-0003: Design Item ID: DB-0003; Type: TP; Footprint Type: THT; Size: 1P0
U2 = DB-0019: Design Item ID: DB-0019; Value: TC4427AEOA; Type: IC DRV FET; Footprint Type: SMD; Size: 8-SOIC; Supplier: THEGIOIIC
U3 U4 = DB-0014: Zero-Drift Amplifier 1 Circuit Rail-to-Rail 8-SOIC; Design Item ID: DB-0014; Value: OPA188AID; Type: IC; Power Rate: N/A; Tolerance: N/A; Footprint Type: SMD; Size: 8-SOIC; Supplier: DIGIKEY; Supplier Part Number: OPA188AID; Supplier Link: https://www.digikey.com/en/products/detail/texas-instruments/OPA188AID/4146941

## Sheet Receiver_VLC.SchDoc
size OrCAD B; SheetNumber: 5; SheetTotal: 7
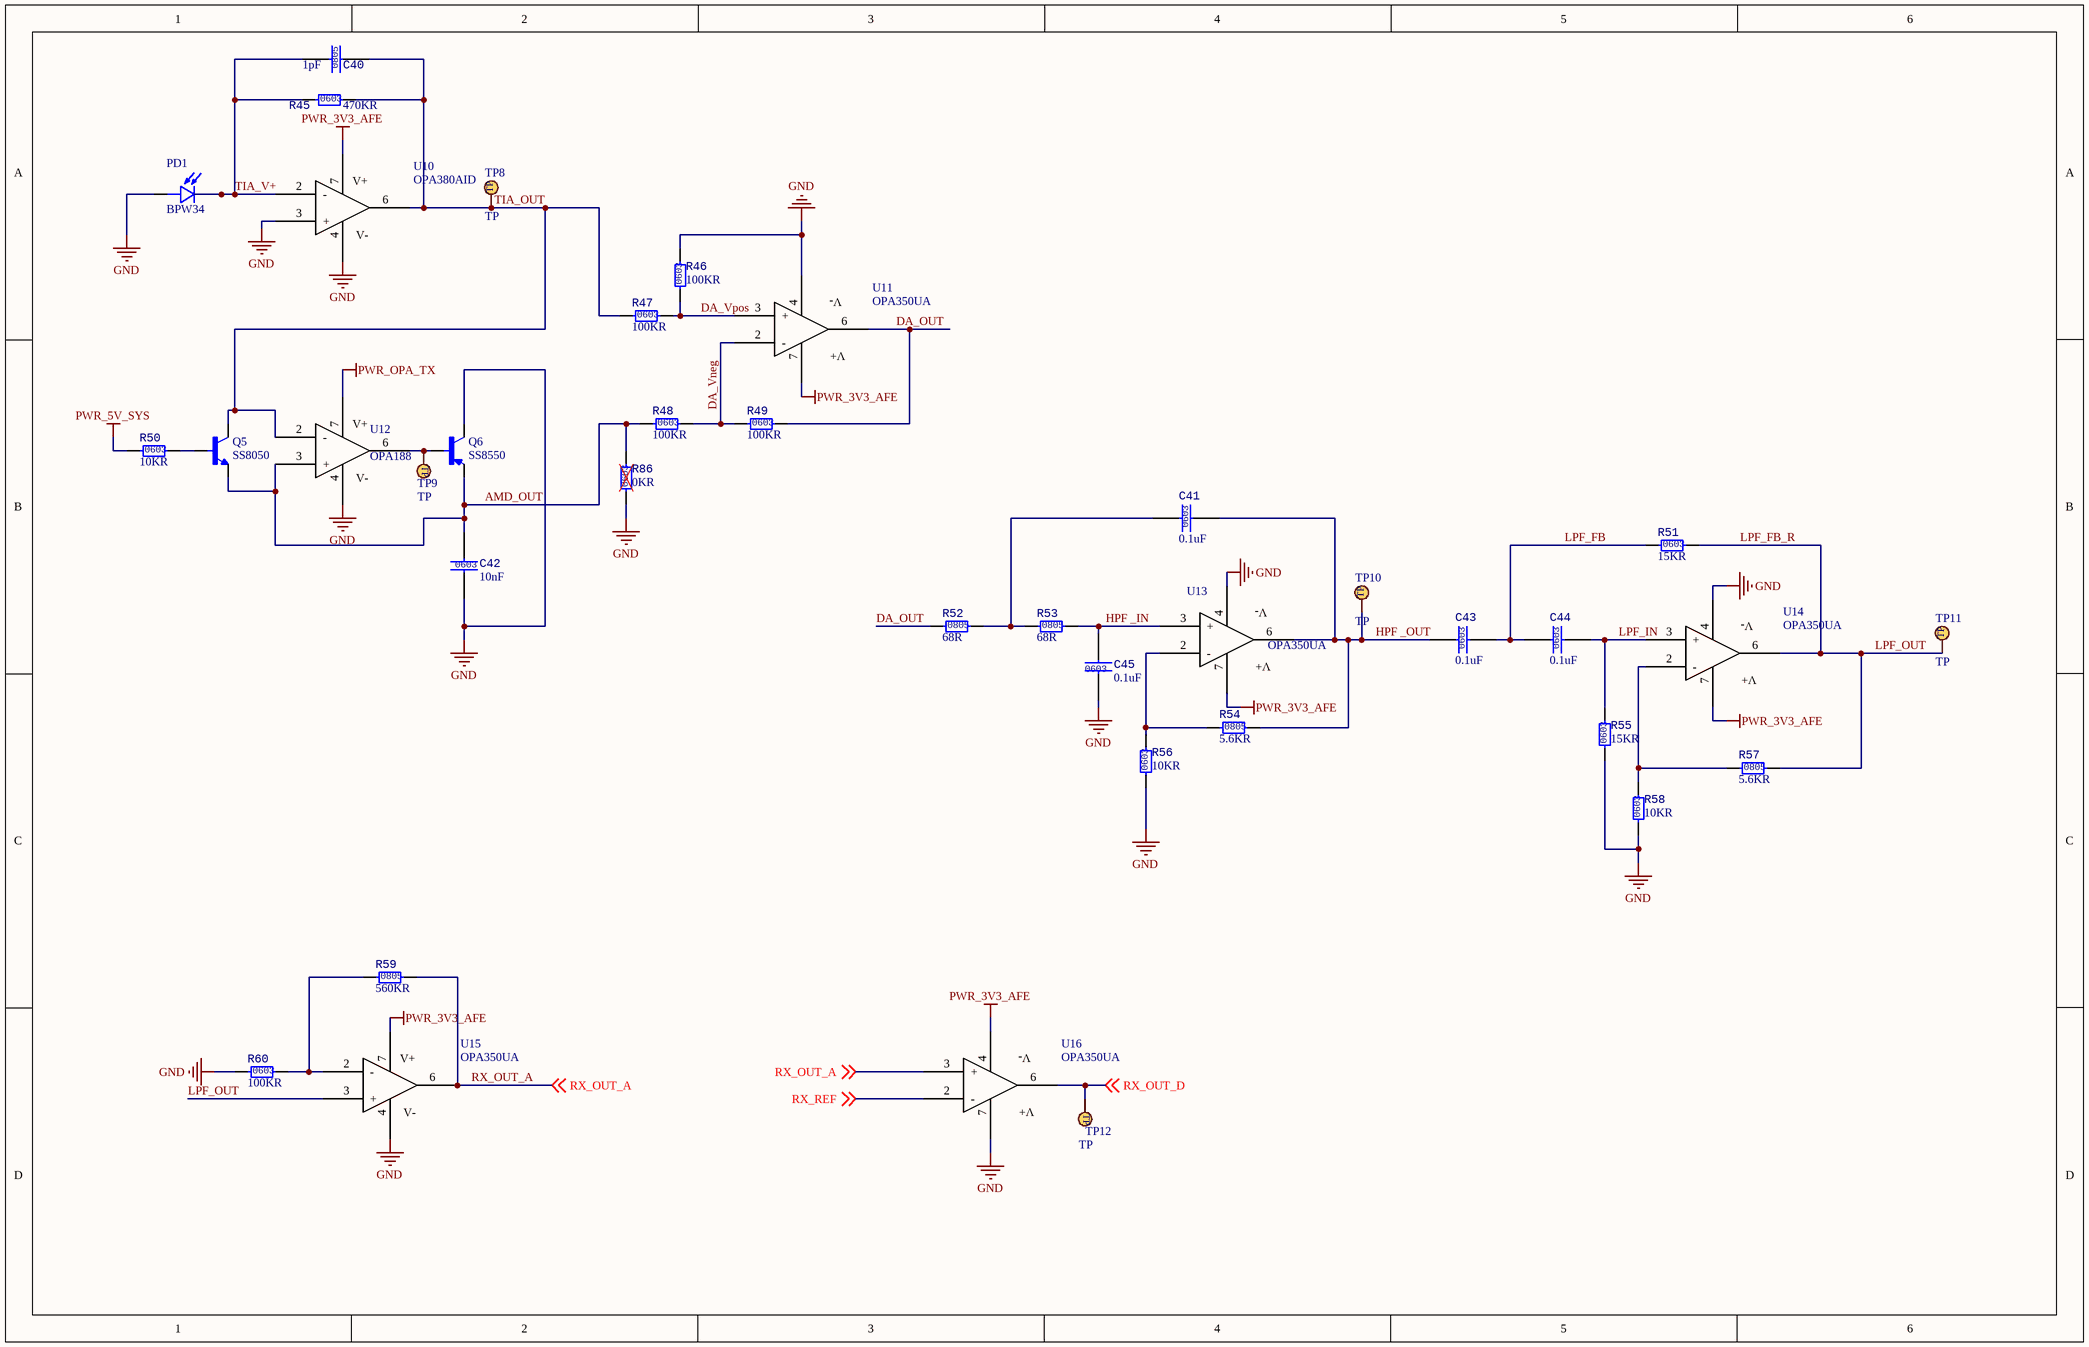
[diagram p4: Receiver_VLC.SchDoc]

### Parts
C40  Size: 0805  [CAPCER 0805 SMD]  (hidden comment: 1pF)
C41  Size: 0603  [CAPCER 0805 SMD]  (hidden comment: 0.1uF)
C42  value 10nF  Size: 0603  [CAPCER 0805 SMD]  (hidden comment: Tụ Gốm 0603 10nF 50V)
C43  Size: 0603  [CAPCER 0805 SMD]  (hidden comment: 0.1uF)
C44  Size: 0603  [CAPCER 0805 SMD]  (hidden comment: 0.1uF)
C45  Size: 0603  [CAPCER 0805 SMD]  (hidden comment: 0.1uF)
PD1  BPW34  [DIP-2]
Q5  SS8050  [SOT23-3]
Q6  SS8550  [SOT23-3]
R45  Size: 0603  [RESC 0603(1608) SMD]  (hidden comment: 470KR)
R46  Size: 0603  [RESC 0603(1608) SMD]  (hidden comment: 100KR)
R47  Size: 0603  [RESC 0603(1608) SMD]  (hidden comment: 100KR)
R48  Size: 0603  [RESC 0603(1608) SMD]  (hidden comment: 100KR)
R49  Size: 0603  [RESC 0603(1608) SMD]  (hidden comment: 100KR)
R50  Size: 0603  [RESC 0603(1608) SMD]  (hidden comment: 10KR)
R51  Size: 0603  [RESC 0603(1608) SMD]  (hidden comment: 15KR)
R52  Size: 0805  [RESC 0805 SMD]  (hidden comment: 68R)
R53  Size: 0805  [RESC 0805 SMD]  (hidden comment: 68R)
R54  Size: 0805  [RESC 0805 SMD]  (hidden comment: 5.6KR)
R55  Size: 0603  [RESC 0603(1608) SMD]  (hidden comment: 15KR)
R56  Size: 0603  [RESC 0603(1608) SMD]  (hidden comment: 10KR)
R57  Size: 0805  [RESC 0805 SMD]  (hidden comment: 5.6KR)
R58  Size: 0603  [RESC 0603(1608) SMD]  (hidden comment: 10KR)
R59  Size: 0805  [RESC 0805 SMD]  (hidden comment: 560KR)
R60  Size: 0603  [RESC 0603(1608) SMD]  (hidden comment: 100KR)
R86  value 0KR  Size: 0603  [RESC 0603(1608) SMD]  (hidden comment: 0R-dni)
TP8  value TP  [TP_THT_1P0]  (hidden comment: TEST POINT)
TP9  value TP  [TP_THT_1P0]  (hidden comment: TEST POINT)
TP10  value TP  [TP_THT_1P0]  (hidden comment: TEST POINT)
TP11  value TP  [TP_THT_1P0]  (hidden comment: TEST POINT)
TP12  value TP  [TP_THT_1P0]  (hidden comment: TEST POINT)
U10  OPA380AID  [8-SOIC-OPA]
U11  OPA350UA  [8-SOIC-OPA]
U12  value OPA188  [8-SOIC-OPA]  (hidden comment: OPA188AID)
U13  OPA350UA  [8-SOIC-OPA]
U14  OPA350UA  [8-SOIC-OPA]
U15  OPA350UA  [8-SOIC-OPA]
U16  OPA350UA  [8-SOIC-OPA]

### Nets
GND: C42.2 C45.1 PD1.A Q6.3(C) R46.2 R55.1 R56.1 R58.1 R60.1 R86.1 U10.3(+) U10.4(GND) U11.4(GND) U12.4(GND) U13.4(GND) U14.4(GND) U15.4(GND) U16.7(VCC)
PWR_3V3_AFE: U10.7(VCC) U11.7(VCC) U13.7(VCC) U14.7(VCC) U15.7(VCC) U16.4(GND)
PWR_5V_SYS: R50.1
PWR_OPA_TX: U12.7(VCC)
AMD_OUT: C42.1 Q5.2(E) Q6.2(E) R48.1 R86.2 U12.3(+)
DA_OUT: R49.2 R52.1 U11.6(OUT_1)
DA_Vneg: R48.2 R49.1 U11.2(-)
DA_Vpos: R46.1 R47.2 U11.3(+)
HPF _IN: C45.2 R53.2 U13.3(+)
HPF _OUT: C41.2 C43.1 R54.2 TP10.1 U13.6(OUT_1)
LPF_FB: C43.2 C44.1 R51.1
LPF_FB_R: R51.2 R57.2 TP11.1 U14.6(OUT_1) U15.3(+)  [also labelled LPF_OUT]
LPF_IN: C44.2 R55.2 U14.3(+)
RX_OUT_A: R59.2 U15.6(OUT_1) U16.3(+) ; off-sheet RX_OUT_A
RX_OUT_D: TP12.1 U16.6(OUT_1) ; off-sheet RX_OUT_D
RX_REF: U16.2(-) ; off-sheet RX_REF
TIA_OUT: C40.2 Q5.3(C) R45.2 R47.1 TP8.1 U10.6(OUT_1) U12.2(-)
TIA_V+: C40.1 PD1.C R45.1 U10.2(-)
NetC41_1: C41.1 R52.2 R53.1
NetQ5_1: Q5.1(B) R50.2
NetQ6_1: Q6.1(B) TP9.1 U12.6(OUT_1)
NetR54_1: R54.1 R56.2 U13.2(-)
NetR57_1: R57.1 R58.2 U14.2(-)
NetR59_1: R59.1 R60.2 U15.2(-)

### Notes on the sheet
- (in symbol DB-0014) V+; V-
- (in symbol DB-0020) V+; V-
- (in symbol DB-0021) V-; V+

### Library data of the parts
C40 = DB-0025: Design Item ID: DB-0025; Value: 1pF; Footprint Type: SMD; Supplier: THEGIOIIC
C41 C43-C45 = DB-0017: CAPACITOR SMD 0.1uF 50V 10% 0603; Design Item ID: DB-0017; Value: 0.1uF; Type: CAPACITOR; Power Rate: N/A; Tolerance: 10%; Footprint Type: SMD; Supplier: THEGIOIIC; Supplier Part Number: Tụ Gốm 0603 100nF (0.1uF) 25V; Supplier Link: https://www.thegioiic.com/tu-gom-0603-100nf-0-1uf-25v
C42 = DB-0079: CAPACITOR SMD 0.01uF 50V 10% 0603; Design Item ID: DB-0079; Type: CAPACITOR; Power Rate: N/A; Tolerance: 10%; Footprint Type: SMD; Supplier: THEGIOIIC; Supplier Part Number: Tụ Gốm 0603 10nF 50V; Supplier Link: https://www.thegioiic.com/tu-gom-0603-100nf-0-1uf-25v
PD1 = DB-0024: Design Item ID: DB-0024; Value: BPW34; Type: PD; Footprint Type: DIP; Size: DIP-2
Q5 = DB-0023: SS8050 Y1 Transistor NPN 25V 1.5A 3 Chân SOT-23; Type: BJT; Design Item ID: DB-0023; Value: SS8050; Footprint Type: SMD; Size: SOT23; Supplier: THEGIOIIC
Q6 = DB-0022: SS8550 Y2 Transistor PNP 25V 1.5A 3 Chân SOT-23; Type: BJT; Design Item ID: DB-0022; Value: SS8550; Footprint Type: SMD; Size: SOT23; Supplier: THEGIOIIC
R45 = DB-0009: RESISTOR SMD 470KR OHM 1% 100mW 0603; Power Rate: 100mW; Design Item ID: DB-0009; Type: RESISTOR; Value: 470KR; Tolerance: 1%; Footprint Type: SMD; Supplier: THEGIOIIC; Supplier Part Number: Điện Trở 470 KOhm 0603 1%; Supplier Link: https://www.thegioiic.com/dien-tro-470-kohm-0603-1-
R46-R49 R60 = DB-0008: RESISTOR SMD 100KR OHM 1% 100mW 0603; Power Rate: 100mW; Design Item ID: DB-0008; Value: 100KR; Type: RESISTOR; Tolerance: 1%; Footprint Type: SMD; Supplier: THEGIOIIC; Supplier Part Number: Điện Trở 100 KOhm 0603 1%; Supplier Link: https://www.thegioiic.com/dien-tro-100-kohm-0603-1-
R50 R56 R58 = DB-0003: RESISTOR SMD 10KR OHM 1% 100mW 0603; Power Rate: 100mW; Design Item ID: DB-0003; Value: 10KR; Type: RESISTOR; Tolerance: 1%; Footprint Type: SMD; Supplier: THEGIOIIC; Supplier Part Number: Điện Trở 10 KOhm 0603 1%; Supplier Link: https://www.thegioiic.com/dien-tro-10-kohm-0603-1-
R51 R55 = Điện Trở 15 KOhm 0603 1%: Power Rate: *; Design Item ID: DB-0034; Value: 15KR; Type: RESISTOR; Footprint Type: SMD; Supplier: THEGIOIIC; Supplier Link: https://www.thegioiic.com/dien-tro-15-kohm-0603-1-
R52 R53 = DB-0033: Điện Trở 68 Ohm 0805 1%; Power Rate: *; Design Item ID: DB-0033; Value: 68R; Type: RESISTOR; Footprint Type: SMD; Supplier: THEGIOIIC; Supplier Link: https://www.thegioiic.com/dien-tro-68-ohm-0805-1-
R54 R57 = DB-0023: RESISTOR SMD 5.6KR OHM 1% 125mW 0805; Power Rate: 125mW; Design Item ID: DB-0023; Value: 5.6KR; Type: RESISTOR; Tolerance: 1%; Footprint Type: SMD; Supplier: THEGIOIIC; Supplier Part Number: Điện Trở 5.6 KOhm 0805 1%; Supplier Link: https://www.thegioiic.com/dien-tro-5-6-kohm-0805-1-
R59 = DB-0026: Power Rate: *; Design Item ID: DB-0026; Value: 560KR; Footprint Type: SMD; Supplier: THEGIOIIC
R86 = DB-0040: RESISTOR SMD 0KR OHM 1% 100mW 0603; Power Rate: 100mW; Design Item ID: DB-0040; Type: RESISTOR; Tolerance: 1%; Footprint Type: SMD; Supplier: THEGIOIIC; Supplier Part Number: Điện Trở 0 Ohm 0603 1%; Supplier Link: https://www.thegioiic.com/dien-tro-0-ohm-0603-1-
TP8-TP12 = DB-0003: Design Item ID: DB-0003; Type: TP; Footprint Type: THT; Size: 1P0
U10 = DB-0020: Design Item ID: DB-0020; Value: OPA380AID; Footprint Type: SMD; Size: 8-SOIC
U11 U13-U16 = DB-0021: Design Item ID: DB-0021; Value: OPA350UA; Footprint Type: SMD; Size: 8-SOIC
U12 = DB-0014: as U3 on sheet Transmitter_MD; Design Item ID: DB-0014; Type: IC; Power Rate: N/A; Tolerance: N/A; Footprint Type: SMD; Size: 8-SOIC; Supplier: DIGIKEY; Supplier Part Number: OPA188AID; Supplier Link: https://www.digikey.com/en/products/detail/texas-instruments/OPA188AID/4146941

## Sheet VOLTAGE_MONITOR.SchDoc
size A; SheetNumber: 6; SheetTotal: 7
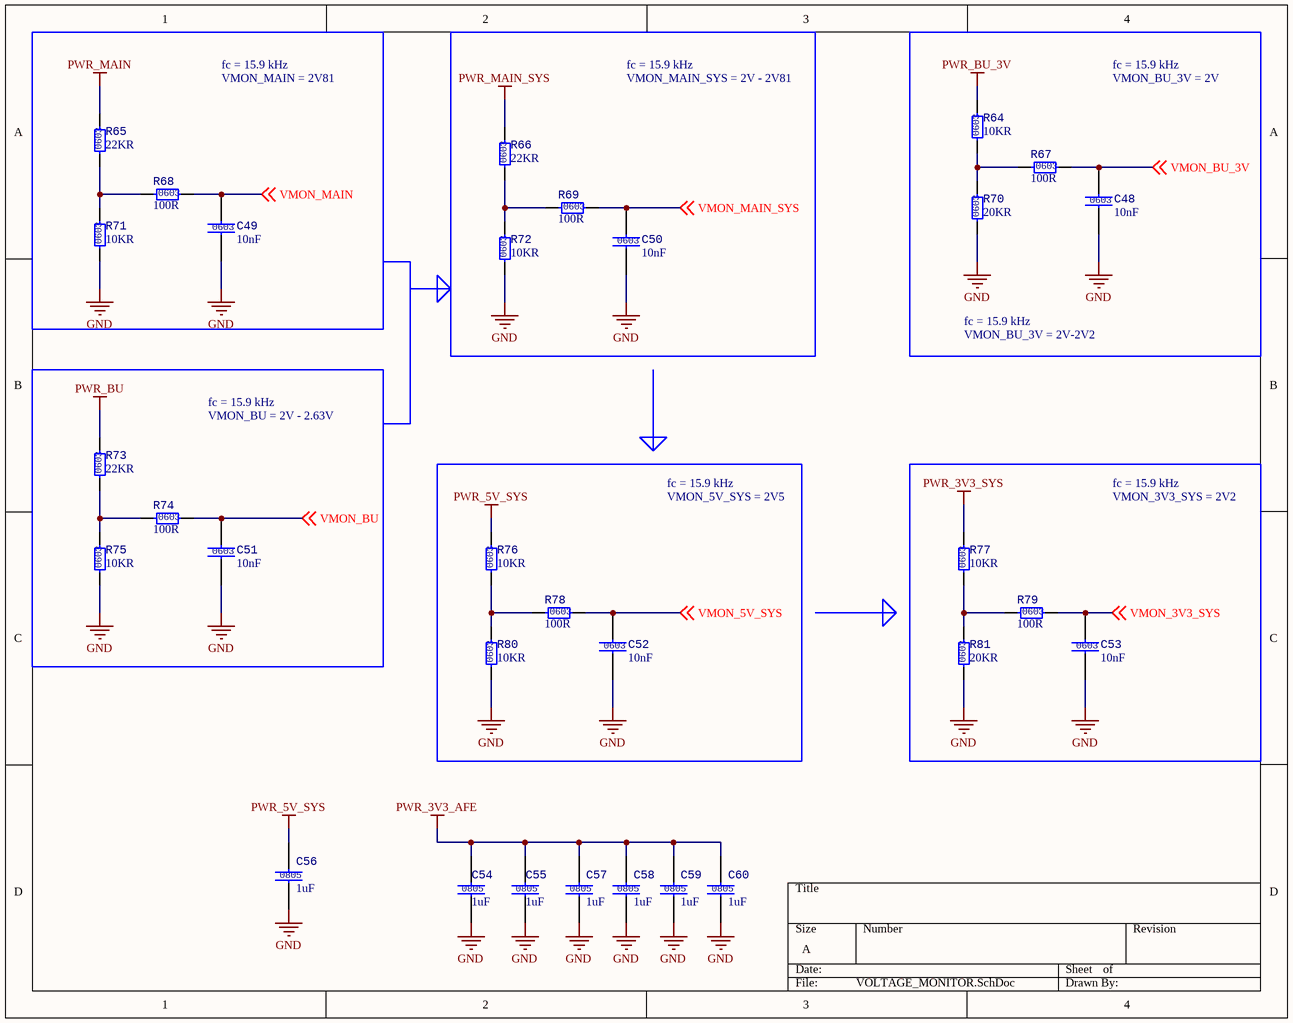
[diagram p5: VOLTAGE_MONITOR.SchDoc]

### Parts
C48  value 10nF  Size: 0603  [CAPCER 0805 SMD]  (hidden comment: Tụ Gốm 0603 10nF 50V)
C49  value 10nF  Size: 0603  [CAPCER 0805 SMD]  (hidden comment: Tụ Gốm 0603 10nF 50V)
C50  value 10nF  Size: 0603  [CAPCER 0805 SMD]  (hidden comment: Tụ Gốm 0603 10nF 50V)
C51  value 10nF  Size: 0603  [CAPCER 0805 SMD]  (hidden comment: Tụ Gốm 0603 10nF 50V)
C52  value 10nF  Size: 0603  [CAPCER 0805 SMD]  (hidden comment: Tụ Gốm 0603 10nF 50V)
C53  value 10nF  Size: 0603  [CAPCER 0805 SMD]  (hidden comment: Tụ Gốm 0603 10nF 50V)
C54  Size: 0805  [CAPCER 0805 SMD]  (hidden comment: 1uF)
C55  Size: 0805  [CAPCER 0805 SMD]  (hidden comment: 1uF)
C56  Size: 0805  [CAPCER 0805 SMD]  (hidden comment: 1uF)
C57  Size: 0805  [CAPCER 0805 SMD]  (hidden comment: 1uF)
C58  value 1uF  Size: 0805  [CAPCER 0603 SMD]  (hidden comment: 10uF)
C59  Size: 0805  [CAPCER 0805 SMD]  (hidden comment: 1uF)
C60  value 1uF  Size: 0805  [CAPCER 0603 SMD]  (hidden comment: 10uF)
R64  Size: 0603  [RESC 0603(1608) SMD]  (hidden comment: 10KR)
R65  Size: 0603  [RESC 0603(1608) SMD]  (hidden comment: 22KR)
R66  Size: 0603  [RESC 0603(1608) SMD]  (hidden comment: 22KR)
R67  Size: 0603  [RESC 0603(1608) SMD]  (hidden comment: 100R)
R68  Size: 0603  [RESC 0603(1608) SMD]  (hidden comment: 100R)
R69  Size: 0603  [RESC 0603(1608) SMD]  (hidden comment: 100R)
R70  Size: 0603  [RESC 0603(1608) SMD]  (hidden comment: 20KR)
R71  Size: 0603  [RESC 0603(1608) SMD]  (hidden comment: 10KR)
R72  Size: 0603  [RESC 0603(1608) SMD]  (hidden comment: 10KR)
R73  Size: 0603  [RESC 0603(1608) SMD]  (hidden comment: 22KR)
R74  Size: 0603  [RESC 0603(1608) SMD]  (hidden comment: 100R)
R75  Size: 0603  [RESC 0603(1608) SMD]  (hidden comment: 10KR)
R76  Size: 0603  [RESC 0603(1608) SMD]  (hidden comment: 10KR)
R77  Size: 0603  [RESC 0603(1608) SMD]  (hidden comment: 10KR)
R78  Size: 0603  [RESC 0603(1608) SMD]  (hidden comment: 100R)
R79  Size: 0603  [RESC 0603(1608) SMD]  (hidden comment: 100R)
R80  Size: 0603  [RESC 0603(1608) SMD]  (hidden comment: 10KR)
R81  Size: 0603  [RESC 0603(1608) SMD]  (hidden comment: 20KR)

### Nets
GND: C48.2 C49.2 C50.2 C51.2 C52.2 C53.2 C54.2 C55.2 C56.2 C57.2 C58.2 C59.2 C60.2 R70.1 R71.1 R72.1 R75.1 R80.1 R81.1
PWR_3V3_AFE: C54.1 C55.1 C57.1 C58.1 C59.1 C60.1
PWR_3V3_SYS: R77.2
PWR_5V_SYS: C56.1 R76.2
PWR_BU: R73.2
PWR_BU_3V: R64.2
PWR_MAIN: R65.2
PWR_MAIN_SYS: R66.2
VMON_3V3_SYS: C53.1 R79.2 ; off-sheet VMON_3V3_SYS
VMON_5V_SYS: C52.1 R78.2 ; off-sheet VMON_5V_SYS
VMON_BU: C51.1 R74.2 ; off-sheet VMON_BU
VMON_BU_3V: C48.1 R67.2 ; off-sheet VMON_BU_3V
VMON_MAIN: C49.1 R68.2 ; off-sheet VMON_MAIN
VMON_MAIN_SYS: C50.1 R69.2 ; off-sheet VMON_MAIN_SYS
NetR64_1: R64.1 R67.1 R70.2
NetR65_1: R65.1 R68.1 R71.2
NetR66_1: R66.1 R69.1 R72.2
NetR73_1: R73.1 R74.1 R75.2
NetR76_1: R76.1 R78.1 R80.2
NetR77_1: R77.1 R79.1 R81.2

### Notes on the sheet
- fc = 15.9 kHz
- VMON_MAIN = 2V81
- VMON_MAIN_SYS = 2V - 2V81
- VMON_BU_3V = 2V
- VMON_BU_3V = 2V-2V2
- VMON_BU = 2V - 2.63V
- VMON_5V_SYS = 2V5
- VMON_3V3_SYS = 2V2

### Library data of the parts
C48-C53 = DB-0079: CAPACITOR SMD 0.01uF 50V 10% 0603; Design Item ID: DB-0079; Type: CAPACITOR; Power Rate: N/A; Tolerance: 10%; Footprint Type: SMD; Supplier: THEGIOIIC; Supplier Part Number: Tụ Gốm 0603 10nF 50V; Supplier Link: https://www.thegioiic.com/tu-gom-0603-100nf-0-1uf-25v
C54-C60 = DB-0063: CAPACITOR SMD 1uF 16V 10% 0805; Design Item ID: DB-0063; Type: CAPACITOR; Power Rate: N/A; Tolerance: 10%; Footprint Type: SMD; Supplier: THEGIOIIC; Supplier Part Number: Tụ Gốm 0805 1uF 16V; Supplier Link: https://www.thegioiic.com/tu-gom-0805-1uf-16v
  C54-C57 C59: Value: 1uF
R64 R71 R72 R75-R77 R80 = DB-0003: RESISTOR SMD 10KR OHM 1% 100mW 0603; Power Rate: 100mW; Design Item ID: DB-0003; Value: 10KR; Type: RESISTOR; Tolerance: 1%; Footprint Type: SMD; Supplier: THEGIOIIC; Supplier Part Number: Điện Trở 10 KOhm 0603 1%; Supplier Link: https://www.thegioiic.com/dien-tro-10-kohm-0603-1-
R65 R66 R73 = DB-0030: Điện Trở 22 KOhm 0603 1%; Power Rate: *; Design Item ID: DB-0030; Value: 22KR; Type: RESISTOR; Footprint Type: SMD; Supplier: THEGIOIIC; Supplier Link: https://www.thegioiic.com/dien-tro-22-kohm-0603-1-
R67-R69 R74 R78 R79 = DB-0032: Điện Trở 100 Ohm 0603 1%; Power Rate: *; Design Item ID: DB-0032; Value: 100R; Type: RESISTOR; Footprint Type: SMD; Supplier: THEGIOIIC; Supplier Link: https://www.thegioiic.com/dien-tro-100-ohm-0603-1-
R70 R81 = DB-0031: Điện Trở 20 KOhm 0603 1%; Power Rate: *; Design Item ID: DB-0031; Value: 20KR; Type: RESISTOR; Footprint Type: SMD; Supplier: THEGIOIIC; Supplier Link: https://www.thegioiic.com/dien-tro-20-kohm-0603-1-

## Sheet PWR_AFE.SchDoc
size A; SheetNumber: 7; SheetTotal: 7
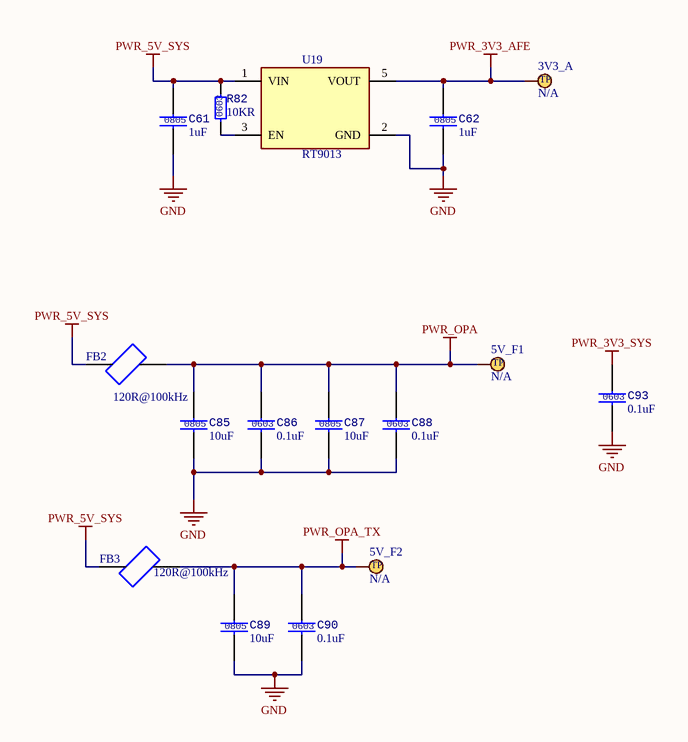
[diagram p6: PWR_AFE.SchDoc]

### Parts
3V3_A  TEST_POINT  [Test_point]  (value not drawn)
5V_F1  TEST_POINT  [Test_point]  (value not drawn)
5V_F2  TEST_POINT  [Test_point]  (value not drawn)
C61  Size: 0805  [CAPCER 0805 SMD]  (hidden comment: 1uF)
C62  Size: 0805  [CAPCER 0805 SMD]  (hidden comment: 1uF)
C85  Size: 0805  [CAPCER 0805 SMD]  (hidden comment: 10uF)
C86  Size: 0603  [CAPCER 0805 SMD]  (hidden comment: 0.1uF)
C87  Size: 0805  [CAPCER 0805 SMD]  (hidden comment: 10uF)
C88  Size: 0603  [CAPCER 0805 SMD]  (hidden comment: 0.1uF)
C89  Size: 0805  [CAPCER 0805 SMD]  (hidden comment: 10uF)
C90  Size: 0603  [CAPCER 0805 SMD]  (hidden comment: 0.1uF)
C93  Size: 0603  [CAPCER 0805 SMD]  (hidden comment: 0.1uF)
FB2  120R@100kHz  [FB 0805]
FB3  120R@100kHz  [FB 0805]
R82  Size: 0603  [RESC 0603(1608) SMD]  (hidden comment: 10KR)
U19  RT9013  [SOT-23-5]

### Nets
GND: C61.2 C62.2 C85.2 C86.2 C87.2 C88.2 C89.2 C90.2 C93.2 U19.2(GND)
PWR_3V3_AFE: 3V3_A.1 C62.1 U19.5(VOUT)
PWR_3V3_SYS: C93.1
PWR_5V_SYS: C61.1 FB2.1 FB3.1 R82.2 U19.1(VIN)
PWR_OPA: 5V_F1.1 C85.1 C86.1 C87.1 C88.1 FB2.2
PWR_OPA_TX: 5V_F2.1 C89.1 C90.1 FB3.2
NetR82_1: R82.1 U19.3(EN)

### Notes on the sheet
- (in symbol DB-0034) TP

### Library data of the parts
3V3_A 5V_F1 5V_F2 = DB-0034: Value: N/A; Design Item ID: DB-0034; Power Rate: N/A; Tolerance: N/A; Footprint Type: PAD; Size: PAD
C61 C62 = DB-0063: CAPACITOR SMD 1uF 16V 10% 0805; Value: 1uF; Design Item ID: DB-0063; Type: CAPACITOR; Power Rate: N/A; Tolerance: 10%; Footprint Type: SMD; Supplier: THEGIOIIC; Supplier Part Number: Tụ Gốm 0805 1uF 16V; Supplier Link: https://www.thegioiic.com/tu-gom-0805-1uf-16v
C85 C87 C89 = DB-0018: CAPACITOR SMD 10uF 25V 10% 0805; Design Item ID: DB-0018; Value: 10uF; Type: CAPACITOR; Power Rate: N/A; Tolerance: 10%; Footprint Type: SMD; Supplier: THEGIOIIC; Supplier Part Number: Tụ Gốm 0805 10uF 25V; Supplier Link: https://www.thegioiic.com/tu-gom-0805-10uf-25v
C86 C88 C90 C93 = DB-0017: CAPACITOR SMD 0.1uF 50V 10% 0603; Design Item ID: DB-0017; Value: 0.1uF; Type: CAPACITOR; Power Rate: N/A; Tolerance: 10%; Footprint Type: SMD; Supplier: THEGIOIIC; Supplier Part Number: Tụ Gốm 0603 100nF (0.1uF) 25V; Supplier Link: https://www.thegioiic.com/tu-gom-0603-100nf-0-1uf-25v
FB2 FB3 = DB-0076: as FB1 on sheet MCU INTERFACE; Design Item ID: DB-0076; Value: 120R@100kHz; Type: FERRITE BEADS; Power Rate: N/A; Tolerance: N/A; Footprint Type: SMD; Size: 0805; Supplier: THEGIOIIC; Supplier Part Number: CBW201209U121T Ferrite Beads 2A 120 Ohm 0805; Supplier Link: https://www.thegioiic.com/cbw201209u121t-ferrite-beads-2a-120-ohm-0805
R82 = DB-0003: RESISTOR SMD 10KR OHM 1% 100mW 0603; Power Rate: 100mW; Value: 10KR; Design Item ID: DB-0003; Type: RESISTOR; Tolerance: 1%; Footprint Type: SMD; Supplier: THEGIOIIC; Supplier Part Number: Điện Trở 10 KOhm 0603 1%; Supplier Link: https://www.thegioiic.com/dien-tro-10-kohm-0603-1-
U19 = DB-0062: IC REG LINEAR 3.3V 500MA SOT23-5; Value: RT9013; Design Item ID: DB-0062; Type: IC; Power Rate: N/A; Tolerance: N/A; Footprint Type: SMD; Size: SOT-23-5; Supplier: THEGIOIIC; Supplier Part Number: RT9013-33GB IC Ổn Áp 3.3V 500mA SOT-23-5; Supplier Link: https://www.thegioiic.com/rt9013-33gb-ic-on-ap-3-3v-500ma-sot-23-5

## Nets that join several sheets
GND: MCU INTERFACE (31 pins), PW SUPPLY (45 pins), UART TO USB LOG (10 pins), Transmitter_MD (9 pins), Receiver_VLC (18 pins), VOLTAGE_MONITOR (19 pins), PWR_AFE (10 pins)
PWR_3V3_AFE: MCU INTERFACE (I2C0.3 R89.2 R90.2), Receiver_VLC (6 pins), VOLTAGE_MONITOR (6 pins), PWR_AFE (3V3_A.1 C62.1 U19.5)
PWR_3V3_SYS: MCU INTERFACE (12 pins), PW SUPPLY (15 pins), UART TO USB LOG (U17.4 U17.16), VOLTAGE_MONITOR (R77.2), PWR_AFE (C93.1)
PWR_5V_SYS: MCU INTERFACE (J1.1 J1.2 J2.1 J2.2), PW SUPPLY (12 pins), Transmitter_MD (R11.2 R13.1 U2.6), Receiver_VLC (R50.1), VOLTAGE_MONITOR (C56.1 R76.2), PWR_AFE (5 pins)
PWR_BU: PW SUPPLY (12 pins), VOLTAGE_MONITOR (R73.2)
PWR_BU_3V: PW SUPPLY (3V.1 C26.1 U7.1 VBAT1.1), VOLTAGE_MONITOR (R64.2)
PWR_MAIN: PW SUPPLY (13 pins), VOLTAGE_MONITOR (R65.2)
PWR_MAIN_SYS: PW SUPPLY (12 pins), VOLTAGE_MONITOR (R66.2)
PWR_OPA: Transmitter_MD (U3.7 U4.7), PWR_AFE (6 pins)
PWR_OPA_TX: Receiver_VLC (U12.7), PWR_AFE (5V_F2.1 C89.1 C90.1 FB3.2)
VBAT_BU: MCU INTERFACE (U1.6), PW SUPPLY (C70.1 U7.3)
CH340G_RXD: MCU INTERFACE (R1.2), UART TO USB LOG (U17.3)
CH340G_TXD: MCU INTERFACE (R2.2), UART TO USB LOG (U17.2)
LED_ISENSE: MCU INTERFACE (J1.8 U1.18), Transmitter_MD (R16.2 U3.6)
LED_VSENSE: MCU INTERFACE (J1.6 U1.17), Transmitter_MD (R20.2 U4.6)
RX_OUT_A: MCU INTERFACE (R91.1), Receiver_VLC (R59.2 U15.6 U16.3)
RX_OUT_D: MCU INTERFACE (R92.1), Receiver_VLC (TP12.1 U16.6)
RX_REF: MCU INTERFACE (J2.6 U1.29), Receiver_VLC (U16.2)
TX_DATA: MCU INTERFACE (R93.1), Transmitter_MD (U2.2)
VMON_3V3_SYS: MCU INTERFACE (U1.31), VOLTAGE_MONITOR (C53.1 R79.2)
VMON_5V_SYS: MCU INTERFACE (U1.30), VOLTAGE_MONITOR (C52.1 R78.2)
VMON_BU: MCU INTERFACE (U1.35), VOLTAGE_MONITOR (C51.1 R74.2)
VMON_BU_3V: MCU INTERFACE (U1.36), VOLTAGE_MONITOR (C48.1 R67.2)
VMON_MAIN: MCU INTERFACE (U1.16), VOLTAGE_MONITOR (C49.1 R68.2)
VMON_MAIN_SYS: MCU INTERFACE (U1.15), VOLTAGE_MONITOR (C50.1 R69.2)